# EAGLE design kicker (EAGLE 9.6.2)
AUTHOR: Elias Michalk, Mike Schmidt; GENERATION: Pasta; TITLE: Kicker; VERSION: 04

## Sheet 1 of 3
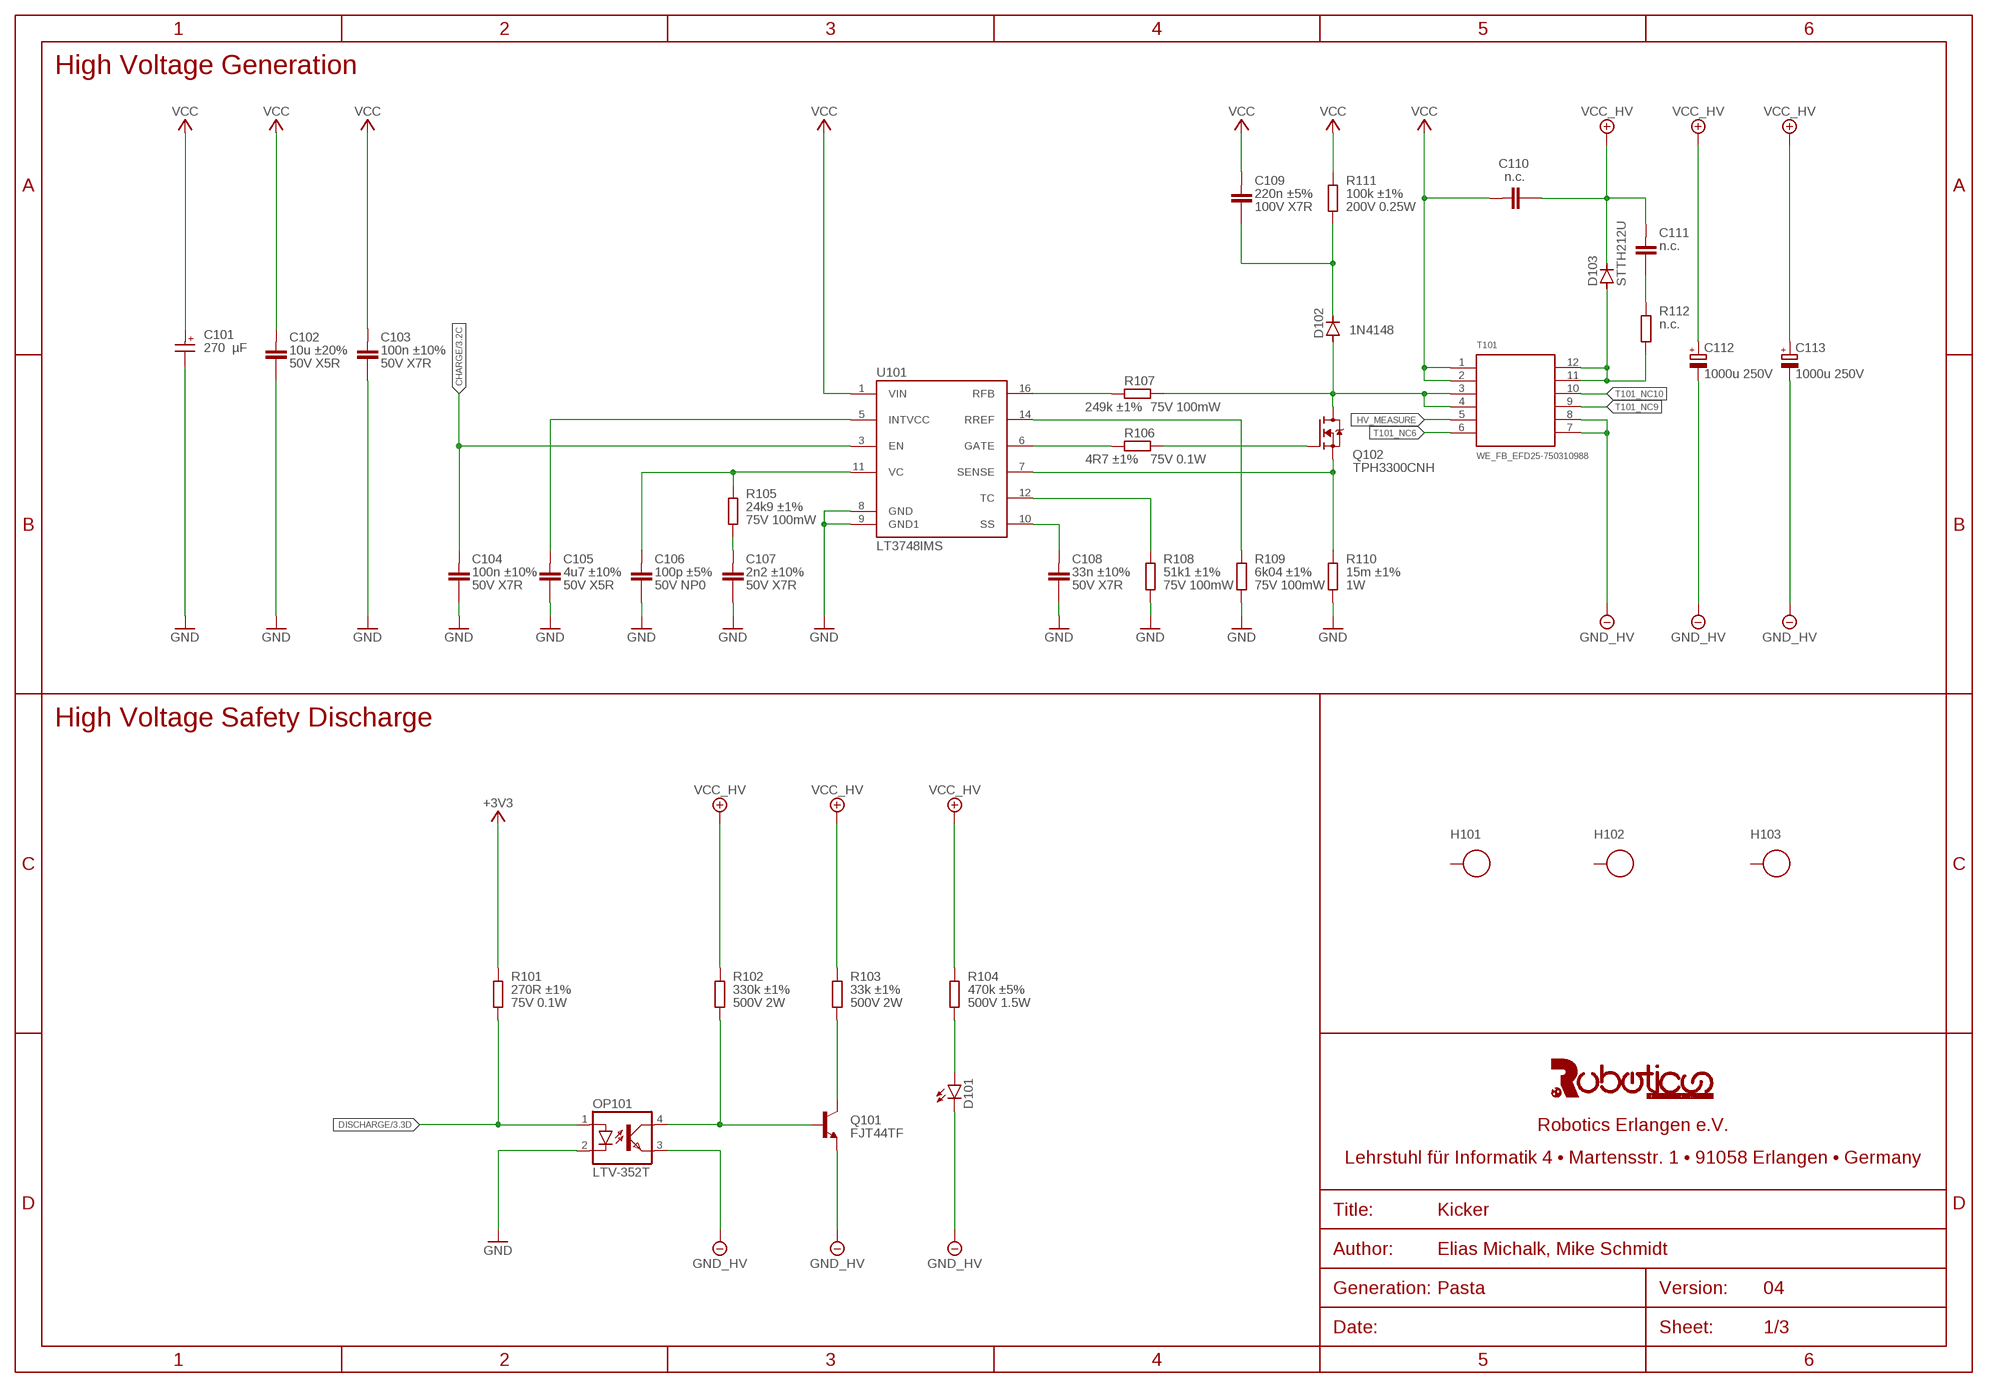
[diagram p0: schematic, sheet 1]

### Parts
C101  270 µF  WCAP-PSLC_10X12.4_875075661009  [WCAP-PSLC_10X12.4(DXL)]
C102  10u ±20% 50V X5R  C(10UF,50V,1206)  [C1206]
C103  100n ±10% 50V X7R  C(100NF,50V,0603)  [C0603]
C104  100n ±10% 50V X7R  C(100NF,50V,0603)  [C0603]
C105  4u7 ±10% 50V X5R  C(4.7UF,50V,0805)  [C0805]
C106  100p ±5% 50V NP0  C(100PF,50V,0603)  [C0603]
C107  2n2 ±10% 50V X7R  C(2.2NF,50V,0603)  [C0603]
C108  33n ±10% 50V X7R  C(33NF,50V,0603)  [C0603]
C109  C(1210)  [C1210]
C110  n.c.  C(N.C.,1206)  [C1206]
C111  n.c.  C(N.C.,1206)  [C1206]
C112  1000u 250V  ESMQ251VSN102MQ45S  [ESMQ251VSN102MQ45S]
C113  1000u 250V  ESMQ251VSN102MQ45S  [ESMQ251VSN102MQ45S]
D101  LED5MM  [LED5MM]
D102  1N4148  1N4148W  [SOD-123]
D103  STTH212U  [SMB]
H101  9774060360R  [9774***360]
H102  9774060360R  [9774***360]
H103  9774060360R  [9774***360]
OP101  LTV-352T  [DIL4-SMD]
Q101  FJT44TF  TRANSISTOR_NPN"  [SOT223]
Q102  TPH3300CNH  [SOP-8]
R101  270R ±1% 75V 0.1W  R(270R,75V,0.1W,0603)  [R0603]
R102  R(2512)  [R2512]
R103  R(2512)  [R2512]
R104  R(2512)  [R2512]
R105  R(0603)  [R0603]
R106  4R7 ±1% 75V 0.1W  R(4.7R,75V,0.1W,0603)  [R0603]
R107  R(0603)  [R0603]
R108  R(0603)  [R0603]
R109  R(0603)  [R0603]
R110  R(1206)  [R1206]
R111  100k ±1% 200V 0.25W  R(100K,200V,0.25W,1206)  [R1206]
R112  n.c.  R(N.C.,1206)  [R1206]
T101  WE_FB_EFD25-750310988  [WE_FB_EFD25]
U101  LT3748IMS  [MSOP16]

### Nets
+3V3: R101.2 ; also sheet 2,3
CHARGE: C104.1 U101.3(EN) ; also sheet 3
DISCHARGE: OP101.1(A) R101.1 ; also sheet 3
GND: C101.2(-) C102.2 C103.2 C104.2 C105.2 C106.2 C107.2 C108.2 OP101.2(C) R108.1 R109.1 R110.1 U101.8(GND) U101.9(GND1) ; also sheet 2,3
GND_HV [HV: 0V - 30V]: C112.N(-) C113.N(-) D101.K(C) OP101.3(EMIT) Q101.3(E) T101.7 T101.8 ; also sheet 2,3
HV_MEASURE [HV: 0V - 250V]: T101.5
N$1: R108.2 U101.12(TC)
N$3 [HV: 0V - 250V]: D103.A R112.1 T101.11 T101.12
N$4: R109.2 U101.14(RREF)
N$8: C108.1 U101.10(SS)
N$9 [HV: 0V - 30V]: D101.A R104.1
N$10 [LV: 0V - 100V]: C109.2 D102.C R111.1
N$13: Q102.1(S) Q102.2(S) Q102.3(S) R110.2 U101.7(SENSE)
N$14: C105.1 U101.5(INTVCC)
N$16: C106.1 R105.2 U101.11(VC)
N$17: C107.1 R105.1
N$18: Q102.4(G) R106.1
N$19: R106.2 U101.6(GATE)
N$21 [LV: 0V - 100V]: R107.2 U101.16(RFB)
N$26 [HV: 0V - 250V]: C111.2 R112.2
N$41 [HV: 0V - 30V]: OP101.4(COL) Q101.1(B) R102.1
N$43 [HV: 0V - 250V]: Q101.2(C) Q101.4(C) R103.1
T101_NC6 [NC]: T101.6
T101_NC9 [NC]: T101.9
T101_NC10 [NC]: T101.10
TRAFO [LV: 0V - 100V]: D102.A Q102.5(D) R107.1 T101.3 T101.4
VCC: C101.1(+) C102.1 C103.1 C109.1 C110.1 R111.2 T101.1 T101.2 U101.1(VIN) ; also sheet 2,3
VCC_HV [HV: 250V]: C110.2 C111.1 C112.P(+) C113.P(+) D103.C R102.2 R103.2 R104.2 ; also sheet 2,3
Unconnected: H101.1 H102.1 H103.1

### Notes on the sheet
- High Voltage Generation
- High Voltage Safety Discharge

## Sheet 2 of 3
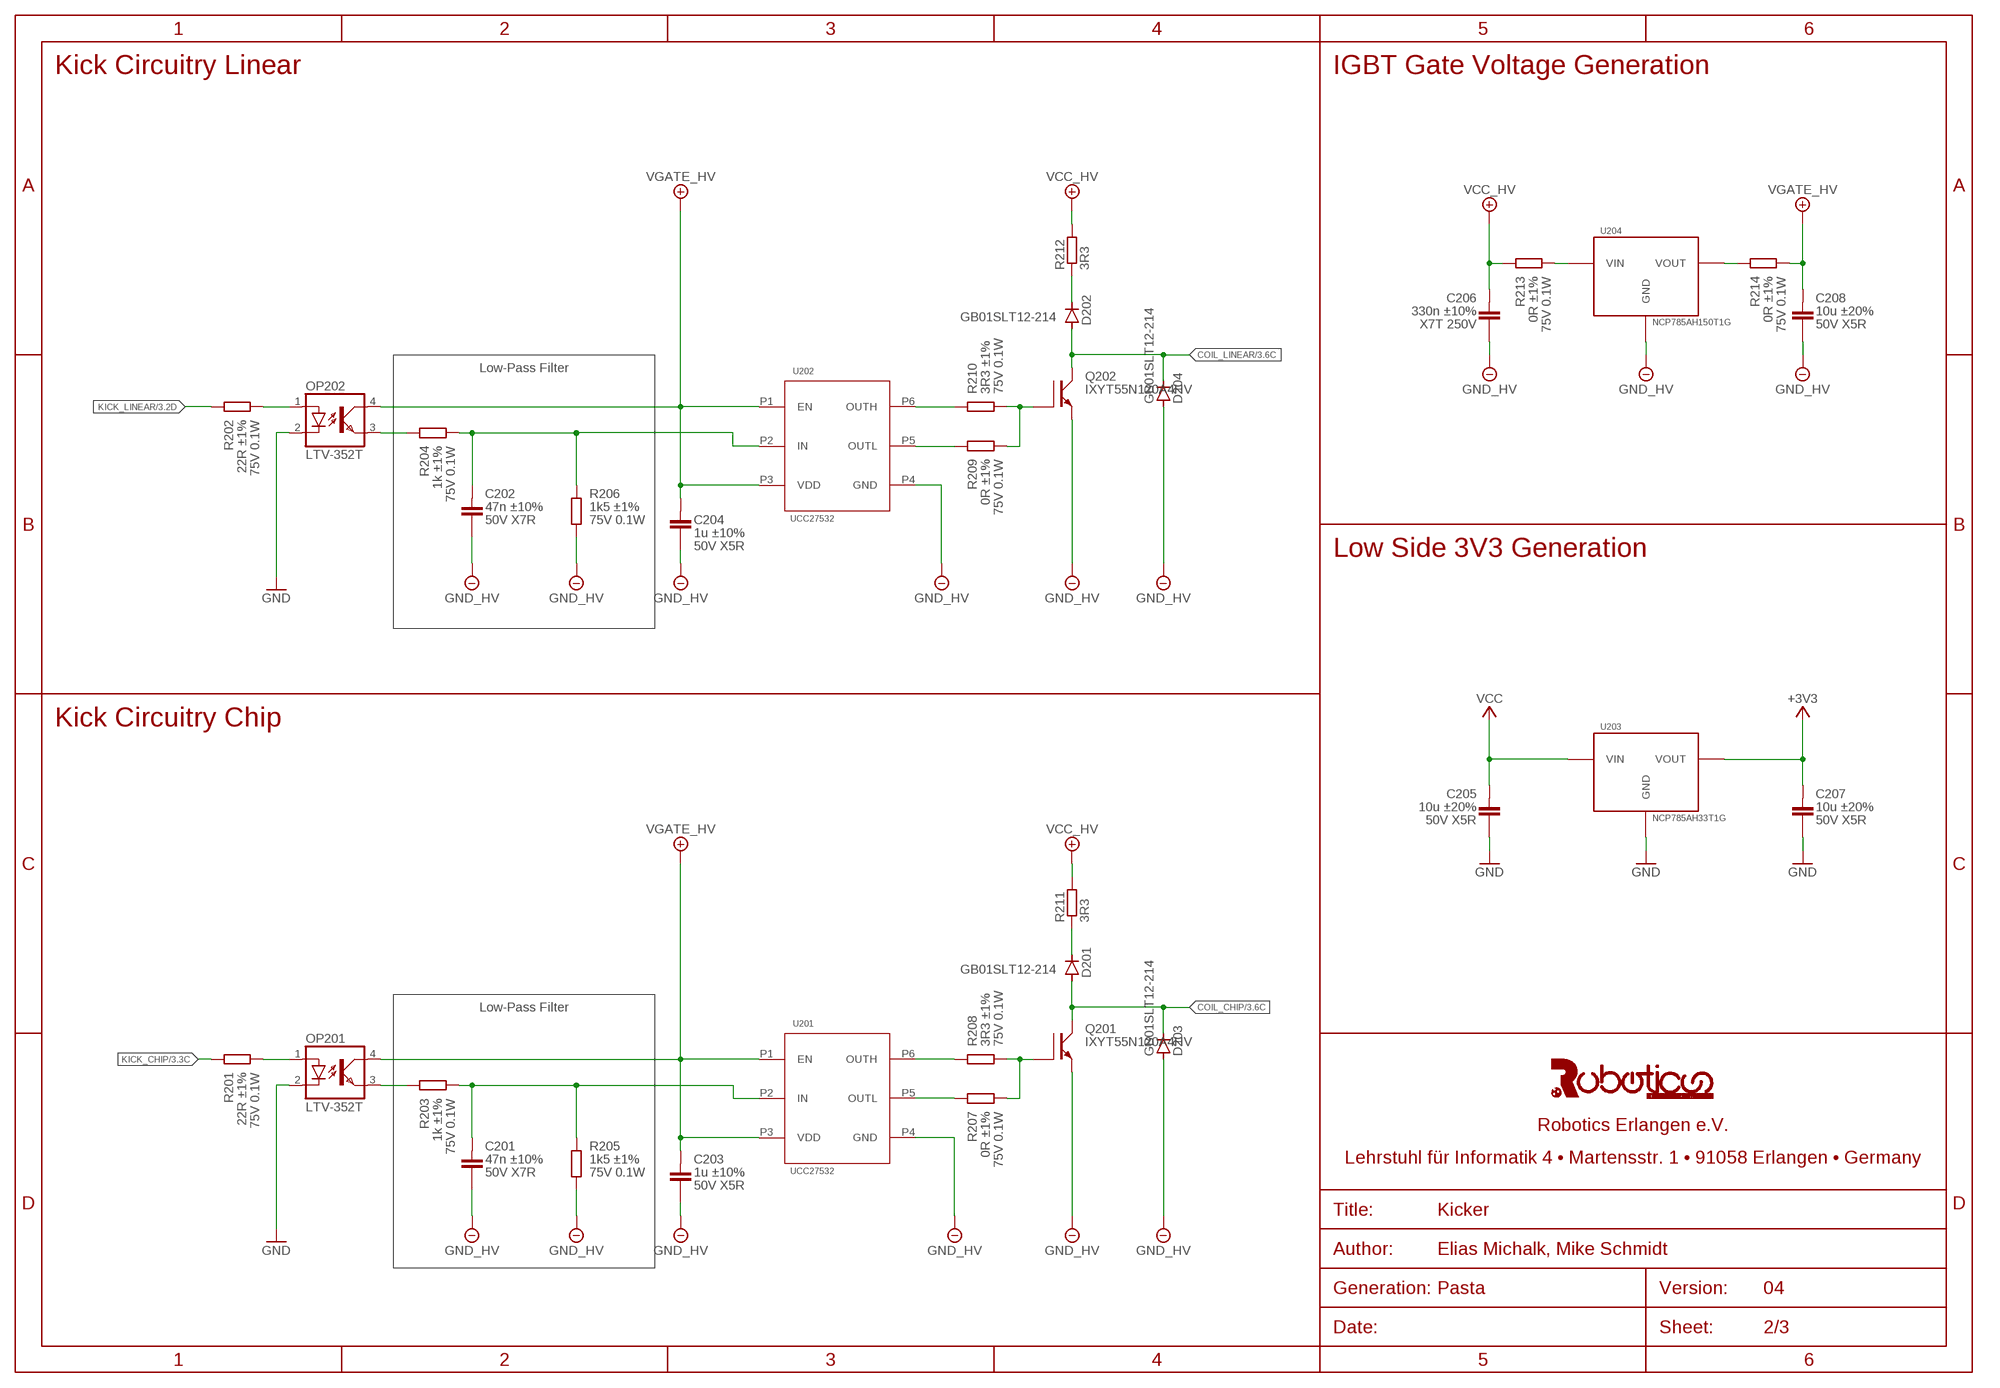
[diagram p1: schematic, sheet 2]

### Parts
C201  47n ±10% 50V X7R  C(47NF,50V,0603)  [C0603]
C202  47n ±10% 50V X7R  C(47NF,50V,0603)  [C0603]
C203  1u ±10% 50V X5R  C(1.0UF,50V,0603)  [C0603]
C204  1u ±10% 50V X5R  C(1.0UF,50V,0603)  [C0603]
C205  10u ±20% 50V X5R  C(10UF,50V,1206)  [C1206]
C206  C(1210)  [C1210]
C207  10u ±20% 50V X5R  C(10UF,50V,1206)  [C1206]
C208  10u ±20% 50V X5R  C(10UF,50V,1206)  [C1206]
D201  GB01SLT12-214  [DO-214]
D202  GB01SLT12-214  [DO-214]
D203  GB01SLT12-214  [DO-214]
D204  GB01SLT12-214  [DO-214]
OP201  LTV-352T  [DIL4-SMD]
OP202  LTV-352T  [DIL4-SMD]
Q201  IXYT55N120A4HV  [TO-268HV]
Q202  IXYT55N120A4HV  [TO-268HV]
R201  22R ±1% 75V 0.1W  R(22R,75V,0.1W,0603)  [R0603]
R202  22R ±1% 75V 0.1W  R(22R,75V,0.1W,0603)  [R0603]
R203  1k ±1% 75V 0.1W  R(1.0K,75V,0.1W,0603)  [R0603]
R204  1k ±1% 75V 0.1W  R(1.0K,75V,0.1W,0603)  [R0603]
R205  1k5 ±1% 75V 0.1W  R(1.5K,75V,0.1W,0603)  [R0603]
R206  1k5 ±1% 75V 0.1W  R(1.5K,75V,0.1W,0603)  [R0603]
R207  0R ±1% 75V 0.1W  R(0R,75V,0.1W,0603)  [R0603]
R208  3R3 ±1% 75V 0.1W  R(3.3R,75V,0.1W,0603)  [R0603]
R209  0R ±1% 75V 0.1W  R(0R,75V,0.1W,0603)  [R0603]
R210  3R3 ±1% 75V 0.1W  R(3.3R,75V,0.1W,0603)  [R0603]
R211  3R3  R-EU_3R3-R4527  [R4527]
R212  3R3  R-EU_3R3-R4527  [R4527]
R213  0R ±1% 75V 0.1W  R(0R,75V,0.1W,0603)  [R0603]
R214  0R ±1% 75V 0.1W  R(0R,75V,0.1W,0603)  [R0603]
U201  UCC27532  [SOT23-6]
U202  UCC27532  [SOT23-6]
U203  NCP785AH33T1G  [NCP785AH*T1G]
U204  NCP785AH150T1G  [NCP785AH*T1G]

### Nets
+3V3: C207.1 U203.3(VOUT) ; also sheet 1,3
COIL_CHIP [HV: 0V - 250V]: D201.A D203.C Q201.3(C) ; also sheet 3
COIL_LINEAR [HV: 0V - 250V]: D202.A D204.C Q202.3(C) ; also sheet 3
GND: C205.2 C207.2 OP201.2(C) OP202.2(C) U203.2(GND) ; also sheet 1,3
GND_HV [HV: 0V - 30V]: C201.2 C202.2 C203.2 C204.2 C206.2 C208.2 D203.A D204.A Q201.1(E) Q202.1(E) R205.1 R206.1 U201.P4(GND) U202.P4(GND) U204.2(GND) ; also sheet 1,3
KICK_CHIP: R201.1 ; also sheet 3
KICK_LINEAR: R202.1 ; also sheet 3
N$2 [HV: 0V - 30V]: OP202.3(EMIT) R204.1
N$5 [HV: 0V - 30V]: OP201.3(EMIT) R203.1
N$7 [HV: 250V]: R213.2 U204.1(VIN)
N$15 [HV: 0V - 30V]: R214.1 U204.3(VOUT)
N$22 [HV: 0V - 30V]: R208.1 U201.P6(OUTH)
N$23 [HV: 0V - 30V]: R210.1 U202.P6(OUTH)
N$24 [HV: 0V - 30V]: R209.1 U202.P5(OUTL)
N$25 [HV: 0V - 30V]: Q202.2(G) R209.2 R210.2
N$27 [HV: 0V - 30V]: C202.1 R204.2 R206.2 U202.P2(IN)
N$28 [HV: 0V - 30V]: R207.1 U201.P5(OUTL)
N$29 [HV: 0V - 30V]: Q201.2(G) R207.2 R208.2
N$30: D202.C R212.1
N$31: OP201.1(A) R201.2
N$33: D201.C R211.1
N$34 [HV: 0V - 30V]: C201.1 R203.2 R205.2 U201.P2(IN)
N$48: OP202.1(A) R202.2
VCC: C205.1 U203.1(VIN) ; also sheet 1,3
VCC_HV [HV: 250V]: C206.1 R211.2 R212.2 R213.1 ; also sheet 1,3
VGATE_HV [HV: 0V - 30V]: C203.1 C204.1 C208.1 OP201.4(COL) OP202.4(COL) R214.2 U201.P1(EN) U201.P3(VDD) U202.P1(EN) U202.P3(VDD) ; also sheet 3

### Notes on the sheet
- Kick Circuitry Linear | IGBT Gate Voltage Generation
- Low-Pass Filter
- Low Side 3V3 Generation
- Kick Circuitry Chip
- Low-Pass Filter

## Sheet 3 of 3
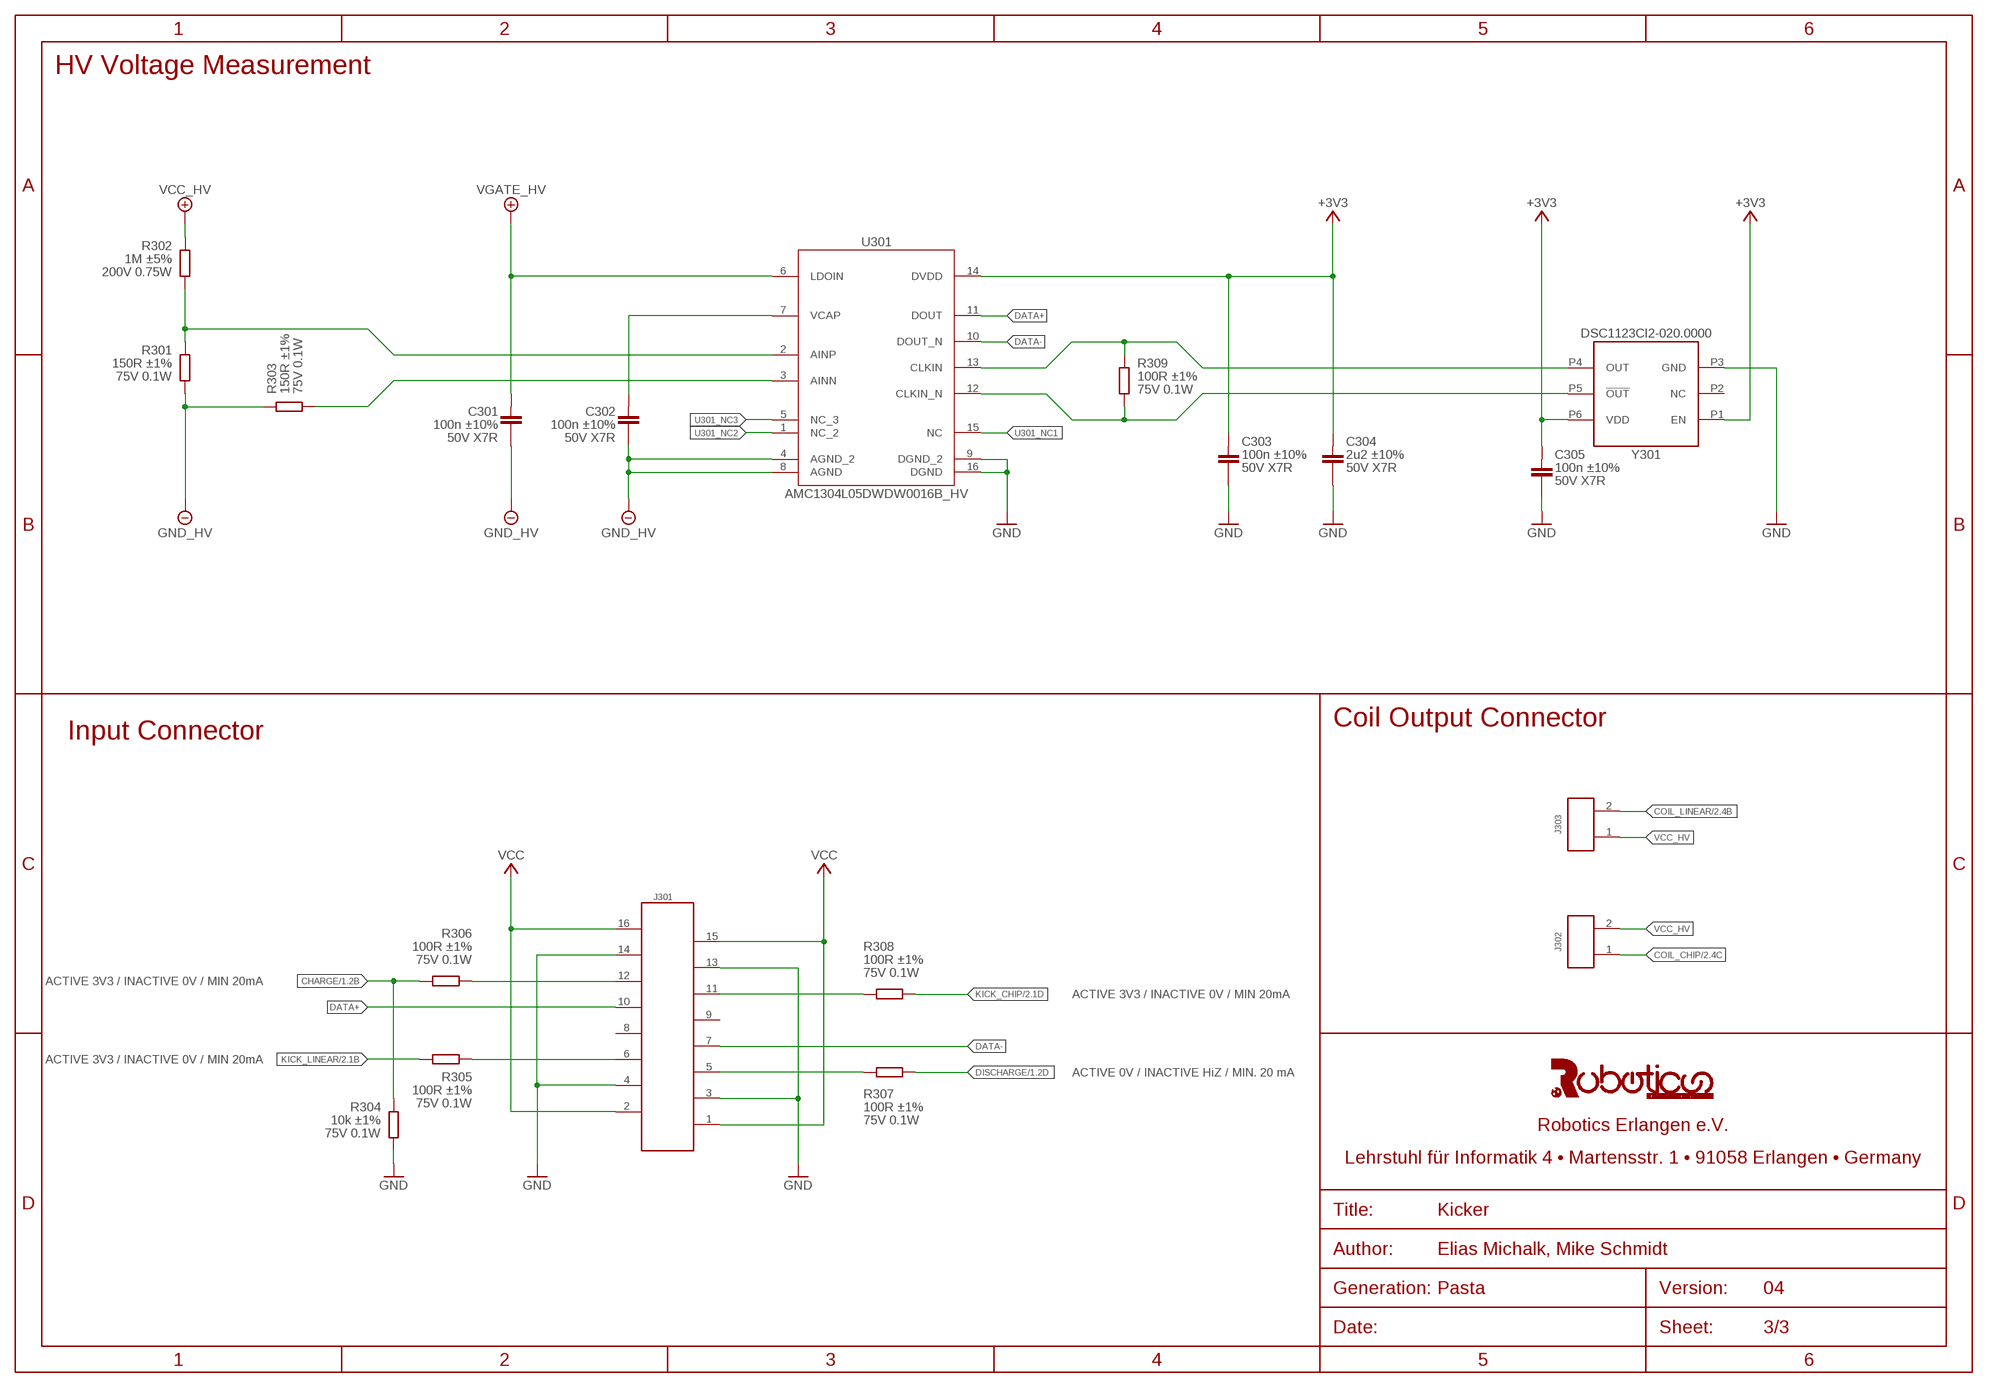
[diagram p2: schematic, sheet 3]

### Parts
C301  100n ±10% 50V X7R  C(100NF,50V,0603)  [C0603]
C302  100n ±10% 50V X7R  C(100NF,50V,0603)  [C0603]
C303  100n ±10% 50V X7R  C(100NF,50V,0603)  [C0603]
C304  2u2 ±10% 50V X7R  C(2.2UF,50V,0805)  [C0805]
C305  100n ±10% 50V X7R  C(100NF,50V,0603)  [C0603]
J301  690367181672  [690367181672]
J302  66100311622  [66100311622*]
J303  66100311622  [66100311622*]
R301  150R ±1% 75V 0.1W  R(150R,75V,0.1W,0603)  [R0603]
R302  R(2010)  [R2010]
R303  150R ±1% 75V 0.1W  R(150R,75V,0.1W,0603)  [R0603]
R304  10k ±1% 75V 0.1W  R(10K,75V,0.1W,0603)  [R0603]
R305  100R ±1% 75V 0.1W  R(100R,75V,0.1W,0603)  [R0603]
R306  100R ±1% 75V 0.1W  R(100R,75V,0.1W,0603)  [R0603]
R307  100R ±1% 75V 0.1W  R(100R,75V,0.1W,0603)  [R0603]
R308  100R ±1% 75V 0.1W  R(100R,75V,0.1W,0603)  [R0603]
R309  100R ±1% 75V 0.1W  R(100R,75V,0.1W,0603)  [R0603]
U301  AMC1304L05DWDW0016B_HV  [DW0016B_HV]
Y301  DSC1123CI2-020.0000  [DSC11X3]

### Nets
+3V3: C303.1 C304.1 C305.1 U301.14(DVDD) Y301.P1(EN) Y301.P6(VDD) ; also sheet 1,2
CHARGE: R304.2 R306.2 ; also sheet 1
CLK-: R309.1 U301.12(CLKIN_N) Y301.P5(!OUT)
COIL_CHIP [HV: 0V - 250V]: J302.1 ; also sheet 2
COIL_LINEAR [HV: 0V - 250V]: J303.2 ; also sheet 2
DATA+: J301.10 U301.11(DOUT)
DATA-: J301.7 U301.10(DOUT_N)
DISCHARGE: R307.2 ; also sheet 1
GND: C303.2 C304.2 C305.2 J301.3 J301.4 J301.13 J301.14 R304.1 U301.9(DGND_2) U301.16(DGND) Y301.P3(GND) ; also sheet 1,2
GND_HV [HV: 0V - 30V]: C301.2 C302.2 R301.1 R303.2 U301.4(AGND_2) U301.8(AGND) ; also sheet 1,2
KICK_CHIP: R308.1 ; also sheet 2
KICK_LINEAR: R305.2 ; also sheet 2
N$6: R309.2 U301.13(CLKIN) Y301.P4(OUT)
N$12 [HV: 0V - 30V]: R301.2 R302.1 U301.2(AINP)
N$20 [HV: 0V - 30V]: R303.1 U301.3(AINN)
N$32: J301.12 R306.1
N$37: J301.6 R305.1
N$38: J301.5 R307.1
N$39 [HV: 0V - 30V]: C302.1 U301.7(VCAP)
N$42: J301.11 R308.2
U301_NC1 [NC]: U301.15(NC)
U301_NC2 [NC]: U301.1(NC_2)
U301_NC3 [NC]: U301.5(NC_3)
VCC: J301.1 J301.2 J301.15 J301.16 ; also sheet 1,2
VCC_HV [HV: 250V]: J302.2 J303.1 R302.2 ; also sheet 1,2
VGATE_HV [HV: 0V - 30V]: C301.1 U301.6(LDOIN) ; also sheet 2
Unconnected: J301.8 J301.9 Y301.P2(NC)

### Notes on the sheet
- HV Voltage Measurement
- Coil Output Connector
- Input Connector
- ACTIVE 3V3 / INACTIVE 0V / MIN 20mA
- ACTIVE 3V3 / INACTIVE 0V / MIN 20mA
- ACTIVE 3V3 / INACTIVE 0V / MIN 20mA
- ACTIVE 0V / INACTIVE HiZ / MIN. 20 mA

## Library data of the parts
C101 = kicker:WCAP-PSLC_10X12.4: WCAP-PSLC Aluminum Polymer Capacitors Large Capacitance Characteristics Large capacitance product series Low ESR over high frequency range High permissible ripple current Mounting style: V-Chip SMT Capacitance range: 10 µF ‒ 2000 µF Capacitance tolerance: ±20 % Voltage range (UR): 6.3 ‒ 100 V(DC) Operating temperature: -55 °C up to +105 °C Endurance: 2000h @ +105 °C Dimensions (DxL) in mm: 8.0 x 11.7 up to 10.0 x 12.4 Recommended soldering: Reflow soldering Applications Low ripple voltage at the switching converter Filtering Smoothing Coupling e.g. High-end power supply, industrial computer, VGA card, charger, digital set-top box <https://www.we-online.com/catalog/media/o14736v209%20Family_WCAP-PSLC.jpg> Details see: https://www.we-online.com/catalog/en/WCAP-PSLC/ Updated by Ella Wu;2020-08-14 2020(C) Würth Elektronik; MF: Würth Elektronik; MPN: 875075661009; TOLERANCE: ±10%; VOLTAGE: 35V(DC)
C102 C205 C207 C208 = capacitors:C(*?): Robotics Erlangen Capacitor Library This library provides a list of predefined capacitors with the following features: It is guaranteed that the capacitor exists with the given value, voltage rating and package size If you choose the capacitor you need (e.g. 2u2 with at least 50V) the package will be automatically choosen The manufacturer's data is automatically added so that exactly that capacitor will be ordered The value of the capacitor will be automatically filled with the most relevant data To choose a capacitor, you need to think about the voltage it must be rated for acc. to your application. Use below table to get a minimum voltage rating for the capacitor, depending on the maximum voltage that will be applied to it in your application. Maximum Voltage Applied Notes Minimum Voltage Rating ≤ 3.3V ≥ 6V3 ≤ 5.0V ≥ 10V ≤ 16.8V ≥ 25V ≤ 33.6V Includes all signals that are at max. VCC ≥ 50V After you determined the minimum voltage rating of the capacitor, search for it in the database of this library and choose the first one, that has at least that rating. The library is primarily sorted by capacitance values. Never change the value of predefined capacitors! Note: If your project requires a very specific capacitor (e.g. low tolerance, high voltage or E-24 upwards), then choose any of the predefined empty devices C(0402), C(0603), C(0805), C(1206), C(1210), or C(1812). Always set the attributes MF, MPN and VALUE for custom capacitors!; CAPACITANCE: 10u; DIELECTRIC: X5R; LINE1: 10u ±20%; LINE2: 50V X5R; MF: Samsung; MPN: CL31A106MBHNNNE; TOLERANCE: ±20%; VOLTAGE: 50V
C103 C104 C301-C303 C305 = capacitors:C(*?): Robotics Erlangen Capacitor Library This library provides a list of predefined capacitors with the following features: It is guaranteed that the capacitor exists with the given value, voltage rating and package size If you choose the capacitor you need (e.g. 2u2 with at least 50V) the package will be automatically choosen The manufacturer's data is automatically added so that exactly that capacitor will be ordered The value of the capacitor will be automatically filled with the most relevant data To choose a capacitor, you need to think about the voltage it must be rated for acc. to your application. Use below table to get a minimum voltage rating for the capacitor, depending on the maximum voltage that will be applied to it in your application. Maximum Voltage Applied Notes Minimum Voltage Rating ≤ 3.3V ≥ 6V3 ≤ 5.0V ≥ 10V ≤ 16.8V ≥ 25V ≤ 33.6V Includes all signals that are at max. VCC ≥ 50V After you determined the minimum voltage rating of the capacitor, search for it in the database of this library and choose the first one, that has at least that rating. The library is primarily sorted by capacitance values. Never change the value of predefined capacitors! Note: If your project requires a very specific capacitor (e.g. low tolerance, high voltage or E-24 upwards), then choose any of the predefined empty devices C(0402), C(0603), C(0805), C(1206), C(1210), or C(1812). Always set the attributes MF, MPN and VALUE for custom capacitors!; CAPACITANCE: 100n; DIELECTRIC: X7R; LINE1: 100n ±10%; LINE2: 50V X7R; MF: Würth Elektronik; MPN: 885012206095; TOLERANCE: ±10%; VOLTAGE: 50V
C105 = capacitors:C(*?): Robotics Erlangen Capacitor Library This library provides a list of predefined capacitors with the following features: It is guaranteed that the capacitor exists with the given value, voltage rating and package size If you choose the capacitor you need (e.g. 2u2 with at least 50V) the package will be automatically choosen The manufacturer's data is automatically added so that exactly that capacitor will be ordered The value of the capacitor will be automatically filled with the most relevant data To choose a capacitor, you need to think about the voltage it must be rated for acc. to your application. Use below table to get a minimum voltage rating for the capacitor, depending on the maximum voltage that will be applied to it in your application. Maximum Voltage Applied Notes Minimum Voltage Rating ≤ 3.3V ≥ 6V3 ≤ 5.0V ≥ 10V ≤ 16.8V ≥ 25V ≤ 33.6V Includes all signals that are at max. VCC ≥ 50V After you determined the minimum voltage rating of the capacitor, search for it in the database of this library and choose the first one, that has at least that rating. The library is primarily sorted by capacitance values. Never change the value of predefined capacitors! Note: If your project requires a very specific capacitor (e.g. low tolerance, high voltage or E-24 upwards), then choose any of the predefined empty devices C(0402), C(0603), C(0805), C(1206), C(1210), or C(1812). Always set the attributes MF, MPN and VALUE for custom capacitors!; CAPACITANCE: 4u7; DIELECTRIC: X5R; LINE1: 4u7 ±10%; LINE2: 50V X5R; MF: Samsung; MPN: CL21A475KBQNNNE; TOLERANCE: ±10%; VOLTAGE: 50V
C106 = capacitors:C(*?): Robotics Erlangen Capacitor Library This library provides a list of predefined capacitors with the following features: It is guaranteed that the capacitor exists with the given value, voltage rating and package size If you choose the capacitor you need (e.g. 2u2 with at least 50V) the package will be automatically choosen The manufacturer's data is automatically added so that exactly that capacitor will be ordered The value of the capacitor will be automatically filled with the most relevant data To choose a capacitor, you need to think about the voltage it must be rated for acc. to your application. Use below table to get a minimum voltage rating for the capacitor, depending on the maximum voltage that will be applied to it in your application. Maximum Voltage Applied Notes Minimum Voltage Rating ≤ 3.3V ≥ 6V3 ≤ 5.0V ≥ 10V ≤ 16.8V ≥ 25V ≤ 33.6V Includes all signals that are at max. VCC ≥ 50V After you determined the minimum voltage rating of the capacitor, search for it in the database of this library and choose the first one, that has at least that rating. The library is primarily sorted by capacitance values. Never change the value of predefined capacitors! Note: If your project requires a very specific capacitor (e.g. low tolerance, high voltage or E-24 upwards), then choose any of the predefined empty devices C(0402), C(0603), C(0805), C(1206), C(1210), or C(1812). Always set the attributes MF, MPN and VALUE for custom capacitors!; CAPACITANCE: 100p; DIELECTRIC: NP0; LINE1: 100p ±5%; LINE2: 50V NP0; MF: Würth Elektronik; MPN: 885012006057; TOLERANCE: ±5%; VOLTAGE: 50V
C107 = capacitors:C(*?): Robotics Erlangen Capacitor Library This library provides a list of predefined capacitors with the following features: It is guaranteed that the capacitor exists with the given value, voltage rating and package size If you choose the capacitor you need (e.g. 2u2 with at least 50V) the package will be automatically choosen The manufacturer's data is automatically added so that exactly that capacitor will be ordered The value of the capacitor will be automatically filled with the most relevant data To choose a capacitor, you need to think about the voltage it must be rated for acc. to your application. Use below table to get a minimum voltage rating for the capacitor, depending on the maximum voltage that will be applied to it in your application. Maximum Voltage Applied Notes Minimum Voltage Rating ≤ 3.3V ≥ 6V3 ≤ 5.0V ≥ 10V ≤ 16.8V ≥ 25V ≤ 33.6V Includes all signals that are at max. VCC ≥ 50V After you determined the minimum voltage rating of the capacitor, search for it in the database of this library and choose the first one, that has at least that rating. The library is primarily sorted by capacitance values. Never change the value of predefined capacitors! Note: If your project requires a very specific capacitor (e.g. low tolerance, high voltage or E-24 upwards), then choose any of the predefined empty devices C(0402), C(0603), C(0805), C(1206), C(1210), or C(1812). Always set the attributes MF, MPN and VALUE for custom capacitors!; CAPACITANCE: 2n2; DIELECTRIC: X7R; LINE1: 2n2 ±10%; LINE2: 50V X7R; MF: Würth Elektronik; MPN: 885012206085; TOLERANCE: ±10%; VOLTAGE: 50V
C108 = capacitors:C(*?): Robotics Erlangen Capacitor Library This library provides a list of predefined capacitors with the following features: It is guaranteed that the capacitor exists with the given value, voltage rating and package size If you choose the capacitor you need (e.g. 2u2 with at least 50V) the package will be automatically choosen The manufacturer's data is automatically added so that exactly that capacitor will be ordered The value of the capacitor will be automatically filled with the most relevant data To choose a capacitor, you need to think about the voltage it must be rated for acc. to your application. Use below table to get a minimum voltage rating for the capacitor, depending on the maximum voltage that will be applied to it in your application. Maximum Voltage Applied Notes Minimum Voltage Rating ≤ 3.3V ≥ 6V3 ≤ 5.0V ≥ 10V ≤ 16.8V ≥ 25V ≤ 33.6V Includes all signals that are at max. VCC ≥ 50V After you determined the minimum voltage rating of the capacitor, search for it in the database of this library and choose the first one, that has at least that rating. The library is primarily sorted by capacitance values. Never change the value of predefined capacitors! Note: If your project requires a very specific capacitor (e.g. low tolerance, high voltage or E-24 upwards), then choose any of the predefined empty devices C(0402), C(0603), C(0805), C(1206), C(1210), or C(1812). Always set the attributes MF, MPN and VALUE for custom capacitors!; CAPACITANCE: 33n; DIELECTRIC: X7R; LINE1: 33n ±10%; LINE2: 50V X7R; MF: Würth Elektronik; MPN: 885012206092; TOLERANCE: ±10%; VOLTAGE: 50V
C109 = capacitors:C(*?): Robotics Erlangen Capacitor Library This library provides a list of predefined capacitors with the following features: It is guaranteed that the capacitor exists with the given value, voltage rating and package size If you choose the capacitor you need (e.g. 2u2 with at least 50V) the package will be automatically choosen The manufacturer's data is automatically added so that exactly that capacitor will be ordered The value of the capacitor will be automatically filled with the most relevant data To choose a capacitor, you need to think about the voltage it must be rated for acc. to your application. Use below table to get a minimum voltage rating for the capacitor, depending on the maximum voltage that will be applied to it in your application. Maximum Voltage Applied Notes Minimum Voltage Rating ≤ 3.3V ≥ 6V3 ≤ 5.0V ≥ 10V ≤ 16.8V ≥ 25V ≤ 33.6V Includes all signals that are at max. VCC ≥ 50V After you determined the minimum voltage rating of the capacitor, search for it in the database of this library and choose the first one, that has at least that rating. The library is primarily sorted by capacitance values. Never change the value of predefined capacitors! Note: If your project requires a very specific capacitor (e.g. low tolerance, high voltage or E-24 upwards), then choose any of the predefined empty devices C(0402), C(0603), C(0805), C(1206), C(1210), or C(1812). Always set the attributes MF, MPN and VALUE for custom capacitors!; CAPACITANCE: 220nF; DIELECTRIC: X7R; LINE1: 220n ±5%; LINE2: 100V X7R; MF: KEMET; MPN: C0805C224J1RECTU; TOLERANCE: ±5%; VOLTAGE: 100V
C110 C111 = capacitors:C(*?): Robotics Erlangen Capacitor Library This library provides a list of predefined capacitors with the following features: It is guaranteed that the capacitor exists with the given value, voltage rating and package size If you choose the capacitor you need (e.g. 2u2 with at least 50V) the package will be automatically choosen The manufacturer's data is automatically added so that exactly that capacitor will be ordered The value of the capacitor will be automatically filled with the most relevant data To choose a capacitor, you need to think about the voltage it must be rated for acc. to your application. Use below table to get a minimum voltage rating for the capacitor, depending on the maximum voltage that will be applied to it in your application. Maximum Voltage Applied Notes Minimum Voltage Rating ≤ 3.3V ≥ 6V3 ≤ 5.0V ≥ 10V ≤ 16.8V ≥ 25V ≤ 33.6V Includes all signals that are at max. VCC ≥ 50V After you determined the minimum voltage rating of the capacitor, search for it in the database of this library and choose the first one, that has at least that rating. The library is primarily sorted by capacitance values. Never change the value of predefined capacitors! Note: If your project requires a very specific capacitor (e.g. low tolerance, high voltage or E-24 upwards), then choose any of the predefined empty devices C(0402), C(0603), C(0805), C(1206), C(1210), or C(1812). Always set the attributes MF, MPN and VALUE for custom capacitors!; CAPACITANCE: n.c.; LINE1: n.c.
C112 C113 = kicker:ESMQ251VSN102MQ45S; MF: United Chemi-Con; MOUSER: 661-ESMQ251VSN102MQ4; MPN: ESMQ251VSN102MQ45S
C201 C202 = capacitors:C(*?): Robotics Erlangen Capacitor Library This library provides a list of predefined capacitors with the following features: It is guaranteed that the capacitor exists with the given value, voltage rating and package size If you choose the capacitor you need (e.g. 2u2 with at least 50V) the package will be automatically choosen The manufacturer's data is automatically added so that exactly that capacitor will be ordered The value of the capacitor will be automatically filled with the most relevant data To choose a capacitor, you need to think about the voltage it must be rated for acc. to your application. Use below table to get a minimum voltage rating for the capacitor, depending on the maximum voltage that will be applied to it in your application. Maximum Voltage Applied Notes Minimum Voltage Rating ≤ 3.3V ≥ 6V3 ≤ 5.0V ≥ 10V ≤ 16.8V ≥ 25V ≤ 33.6V Includes all signals that are at max. VCC ≥ 50V After you determined the minimum voltage rating of the capacitor, search for it in the database of this library and choose the first one, that has at least that rating. The library is primarily sorted by capacitance values. Never change the value of predefined capacitors! Note: If your project requires a very specific capacitor (e.g. low tolerance, high voltage or E-24 upwards), then choose any of the predefined empty devices C(0402), C(0603), C(0805), C(1206), C(1210), or C(1812). Always set the attributes MF, MPN and VALUE for custom capacitors!; CAPACITANCE: 47n; DIELECTRIC: X7R; LINE1: 47n ±10%; LINE2: 50V X7R; MF: Würth Elektronik; MPN: 885012206093; TOLERANCE: ±10%; VOLTAGE: 50V
C203 C204 = capacitors:C(*?): Robotics Erlangen Capacitor Library This library provides a list of predefined capacitors with the following features: It is guaranteed that the capacitor exists with the given value, voltage rating and package size If you choose the capacitor you need (e.g. 2u2 with at least 50V) the package will be automatically choosen The manufacturer's data is automatically added so that exactly that capacitor will be ordered The value of the capacitor will be automatically filled with the most relevant data To choose a capacitor, you need to think about the voltage it must be rated for acc. to your application. Use below table to get a minimum voltage rating for the capacitor, depending on the maximum voltage that will be applied to it in your application. Maximum Voltage Applied Notes Minimum Voltage Rating ≤ 3.3V ≥ 6V3 ≤ 5.0V ≥ 10V ≤ 16.8V ≥ 25V ≤ 33.6V Includes all signals that are at max. VCC ≥ 50V After you determined the minimum voltage rating of the capacitor, search for it in the database of this library and choose the first one, that has at least that rating. The library is primarily sorted by capacitance values. Never change the value of predefined capacitors! Note: If your project requires a very specific capacitor (e.g. low tolerance, high voltage or E-24 upwards), then choose any of the predefined empty devices C(0402), C(0603), C(0805), C(1206), C(1210), or C(1812). Always set the attributes MF, MPN and VALUE for custom capacitors!; CAPACITANCE: 1u; DIELECTRIC: X5R; LINE1: 1u ±10%; LINE2: 50V X5R; MF: Samsung; MPN: CL10A105KB8NNNC; TOLERANCE: ±10%; VOLTAGE: 50V
C206 = capacitors:C(*?): Robotics Erlangen Capacitor Library This library provides a list of predefined capacitors with the following features: It is guaranteed that the capacitor exists with the given value, voltage rating and package size If you choose the capacitor you need (e.g. 2u2 with at least 50V) the package will be automatically choosen The manufacturer's data is automatically added so that exactly that capacitor will be ordered The value of the capacitor will be automatically filled with the most relevant data To choose a capacitor, you need to think about the voltage it must be rated for acc. to your application. Use below table to get a minimum voltage rating for the capacitor, depending on the maximum voltage that will be applied to it in your application. Maximum Voltage Applied Notes Minimum Voltage Rating ≤ 3.3V ≥ 6V3 ≤ 5.0V ≥ 10V ≤ 16.8V ≥ 25V ≤ 33.6V Includes all signals that are at max. VCC ≥ 50V After you determined the minimum voltage rating of the capacitor, search for it in the database of this library and choose the first one, that has at least that rating. The library is primarily sorted by capacitance values. Never change the value of predefined capacitors! Note: If your project requires a very specific capacitor (e.g. low tolerance, high voltage or E-24 upwards), then choose any of the predefined empty devices C(0402), C(0603), C(0805), C(1206), C(1210), or C(1812). Always set the attributes MF, MPN and VALUE for custom capacitors!; CAPACITANCE: 330n; DIELECTRIC: X7T; LINE1: 330n ±10%; LINE2: X7T 250V; MF: TDK; MPN: C3225X7T2E334K200AA; TOLERANCE: ±10%; VOLTAGE: 250V
C304 = capacitors:C(*?): Robotics Erlangen Capacitor Library This library provides a list of predefined capacitors with the following features: It is guaranteed that the capacitor exists with the given value, voltage rating and package size If you choose the capacitor you need (e.g. 2u2 with at least 50V) the package will be automatically choosen The manufacturer's data is automatically added so that exactly that capacitor will be ordered The value of the capacitor will be automatically filled with the most relevant data To choose a capacitor, you need to think about the voltage it must be rated for acc. to your application. Use below table to get a minimum voltage rating for the capacitor, depending on the maximum voltage that will be applied to it in your application. Maximum Voltage Applied Notes Minimum Voltage Rating ≤ 3.3V ≥ 6V3 ≤ 5.0V ≥ 10V ≤ 16.8V ≥ 25V ≤ 33.6V Includes all signals that are at max. VCC ≥ 50V After you determined the minimum voltage rating of the capacitor, search for it in the database of this library and choose the first one, that has at least that rating. The library is primarily sorted by capacitance values. Never change the value of predefined capacitors! Note: If your project requires a very specific capacitor (e.g. low tolerance, high voltage or E-24 upwards), then choose any of the predefined empty devices C(0402), C(0603), C(0805), C(1206), C(1210), or C(1812). Always set the attributes MF, MPN and VALUE for custom capacitors!; CAPACITANCE: 2u2; DIELECTRIC: X7R; LINE1: 2u2 ±10%; LINE2: 50V X7R; MF: Samsung; MPN: CL21B225KBYNNWE; TOLERANCE: ±10%; VOLTAGE: 50V
D101 = kicker:LED; MF: Würth Elektronik; MPN: 151054RS03000
D102 = kicker:1N4148W: DIODE; MF: Micro Commercial Components; MPN: 1N4148W
D103 = kicker:STTH212U: DIODE; MF: STMicroelectronics; MPN: STTH212U
D201-D204 = kicker:GB01SLT12-214; MF: GeneSiC; MOUSER: 905-GB01SLT06-214; MPN: GB01SLT06-214
H101-H103 = kicker:9774*360R; MF: Würth Elektronik; MPN: 9774060360R
J301 = kicker:690367181672: WR-MM Female Connector without Latch and without Polarization, 16 Pins=>Code : Con_BTB_MM_Female_THT_St_690367181672 <http://katalog.we-online.de/media/thumbs2/eican/thb_Con_BTB_MM_Female_THT_St_69036718xx72_pf2.jpg> Details see: http://katalog.we-online.de/en/em/6903_6718_xx_72 Created 2014-06-04, Karrer Zheng 2014 (C) Würth Elektronik; MF: Würth Elektronik; MPN: 690367181672
J302 J303 = kicker:66100311622: Male Vertical Shrouded Header; MF: Würth Elektronik; MPN: 66100311622
OP101 OP201 OP202 = kicker:LTV-352T: OPTO COUPLER Source: LITEON, LTV816.pdf; MF: Lite-On; MOUSER: 859-LTV-352T; MPN: LTV-352T
Q101 = kicker:TRANSISTOR_NPN: Transistor NPN BJT configuration in SOT23 package. MMBT2222 is the common NPN we use. Double check BCE configuration again layout.; MF: onsemi / Fairchild; MPN: FJT44TF
Q102 = kicker:TPH3300CNH; MF: Toshiba; MOUSER: 757-TPH3300CNHL1Q; MPN: TPH3300CNH
Q201 Q202 = kicker:IXYT55N120A4HV; MF: IXYS; MOUSER: 747-IXYT55N120A4HV; MPN: IXYT55N120A4HV
R101 = resistors:R(*?): Robotics Erlangen Resistor Library This library provides a list of predefined resistors with the following features: It is guaranteed that the resistor exists with the given value, voltage rating and package size If you choose the resistor you need (e.g. 10k with at least 75V and 0.1W) the package will be automatically choosen The manufacturer's data is automatically added so that exactly that resistor will be ordered The value of the resistor will be automatically filled with the most relevant data To choose a resistor, you have to determine the maximum operating voltage and power dissipation that will be applied to that resistor in your design. With these two values you can choose the minimum package acc. to below table, which lists the maximum operating voltage and power dissipation for each package. Always try to use a package with a voltage rating of at least twice your max. operating voltage and always keep a little marging between your power dissipation and the maximum power dissipation of the package (although typically, resistors can be overloaded by a factor of five for a short time period, i.e. less than a second). Package Maximum Operating Voltage Maximum Power Dissipation 0402 ≤ 50V ≤ 62.5 mW 0603 ≤ 75V ≤ 100 mW 0805 ≤ 150V ≤ 125 mW 1206 ≤ 200V ≤ 250 mW 1210 ≤ 200V ≤ 500 mW 2512 ≤ 200V ≤ 1 W Note: If your project requires a very specific resistor (e.g. low tolerance, high voltage / power dissipation or E-24 upwards), then choose any of the predefined empty devices R(0402), R(0603), R(0805), R(1206), R(1210), or R(2512). Always set the attributes MF, MPN and VALUE for custom resistors! Never change the value of non-custom resistors!; LINE1: 270R ±1%; LINE2: 75V 0.1W; MF: YAGEO; MPN: RC0603FR-07270RL; POWER: 0.1W; RESISTANCE: 270R; TOLERANCE: ±1%; VOLTAGE: 75V
R102 = resistors:R(*?): Robotics Erlangen Resistor Library This library provides a list of predefined resistors with the following features: It is guaranteed that the resistor exists with the given value, voltage rating and package size If you choose the resistor you need (e.g. 10k with at least 75V and 0.1W) the package will be automatically choosen The manufacturer's data is automatically added so that exactly that resistor will be ordered The value of the resistor will be automatically filled with the most relevant data To choose a resistor, you have to determine the maximum operating voltage and power dissipation that will be applied to that resistor in your design. With these two values you can choose the minimum package acc. to below table, which lists the maximum operating voltage and power dissipation for each package. Always try to use a package with a voltage rating of at least twice your max. operating voltage and always keep a little marging between your power dissipation and the maximum power dissipation of the package (although typically, resistors can be overloaded by a factor of five for a short time period, i.e. less than a second). Package Maximum Operating Voltage Maximum Power Dissipation 0402 ≤ 50V ≤ 62.5 mW 0603 ≤ 75V ≤ 100 mW 0805 ≤ 150V ≤ 125 mW 1206 ≤ 200V ≤ 250 mW 1210 ≤ 200V ≤ 500 mW 2512 ≤ 200V ≤ 1 W Note: If your project requires a very specific resistor (e.g. low tolerance, high voltage / power dissipation or E-24 upwards), then choose any of the predefined empty devices R(0402), R(0603), R(0805), R(1206), R(1210), or R(2512). Always set the attributes MF, MPN and VALUE for custom resistors! Never change the value of non-custom resistors!; LINE1: 330k ±1%; LINE2: 500V 2W; MF: TE Connectivity / Holsworthy; MPN: CRGP2512F330K; POWER: 2W; RESISTANCE: 330k; TOLERANCE: ±1%; VOLTAGE: 500V
R103 = resistors:R(*?): Robotics Erlangen Resistor Library This library provides a list of predefined resistors with the following features: It is guaranteed that the resistor exists with the given value, voltage rating and package size If you choose the resistor you need (e.g. 10k with at least 75V and 0.1W) the package will be automatically choosen The manufacturer's data is automatically added so that exactly that resistor will be ordered The value of the resistor will be automatically filled with the most relevant data To choose a resistor, you have to determine the maximum operating voltage and power dissipation that will be applied to that resistor in your design. With these two values you can choose the minimum package acc. to below table, which lists the maximum operating voltage and power dissipation for each package. Always try to use a package with a voltage rating of at least twice your max. operating voltage and always keep a little marging between your power dissipation and the maximum power dissipation of the package (although typically, resistors can be overloaded by a factor of five for a short time period, i.e. less than a second). Package Maximum Operating Voltage Maximum Power Dissipation 0402 ≤ 50V ≤ 62.5 mW 0603 ≤ 75V ≤ 100 mW 0805 ≤ 150V ≤ 125 mW 1206 ≤ 200V ≤ 250 mW 1210 ≤ 200V ≤ 500 mW 2512 ≤ 200V ≤ 1 W Note: If your project requires a very specific resistor (e.g. low tolerance, high voltage / power dissipation or E-24 upwards), then choose any of the predefined empty devices R(0402), R(0603), R(0805), R(1206), R(1210), or R(2512). Always set the attributes MF, MPN and VALUE for custom resistors! Never change the value of non-custom resistors!; LINE1: 33k ±1%; LINE2: 500V 2W; MF: TE Connectivity / Holsworthy; MPN: CRGP2512F33K; POWER: 2W; RESISTANCE: 33k; TOLERANCE: 1%; VOLTAGE: 500V
R104 = resistors:R(*?): Robotics Erlangen Resistor Library This library provides a list of predefined resistors with the following features: It is guaranteed that the resistor exists with the given value, voltage rating and package size If you choose the resistor you need (e.g. 10k with at least 75V and 0.1W) the package will be automatically choosen The manufacturer's data is automatically added so that exactly that resistor will be ordered The value of the resistor will be automatically filled with the most relevant data To choose a resistor, you have to determine the maximum operating voltage and power dissipation that will be applied to that resistor in your design. With these two values you can choose the minimum package acc. to below table, which lists the maximum operating voltage and power dissipation for each package. Always try to use a package with a voltage rating of at least twice your max. operating voltage and always keep a little marging between your power dissipation and the maximum power dissipation of the package (although typically, resistors can be overloaded by a factor of five for a short time period, i.e. less than a second). Package Maximum Operating Voltage Maximum Power Dissipation 0402 ≤ 50V ≤ 62.5 mW 0603 ≤ 75V ≤ 100 mW 0805 ≤ 150V ≤ 125 mW 1206 ≤ 200V ≤ 250 mW 1210 ≤ 200V ≤ 500 mW 2512 ≤ 200V ≤ 1 W Note: If your project requires a very specific resistor (e.g. low tolerance, high voltage / power dissipation or E-24 upwards), then choose any of the predefined empty devices R(0402), R(0603), R(0805), R(1206), R(1210), or R(2512). Always set the attributes MF, MPN and VALUE for custom resistors! Never change the value of non-custom resistors!; LINE1: 470k ±5%; LINE2: 500V 1.5W; MF: Vishay / Dale; MPN: CRCW2512470KJNEGHP; POWER: 1.5W; RESISTANCE: 470k; TOLERANCE: ±5%; VOLTAGE: 500V
R105 = resistors:R(*?): Robotics Erlangen Resistor Library This library provides a list of predefined resistors with the following features: It is guaranteed that the resistor exists with the given value, voltage rating and package size If you choose the resistor you need (e.g. 10k with at least 75V and 0.1W) the package will be automatically choosen The manufacturer's data is automatically added so that exactly that resistor will be ordered The value of the resistor will be automatically filled with the most relevant data To choose a resistor, you have to determine the maximum operating voltage and power dissipation that will be applied to that resistor in your design. With these two values you can choose the minimum package acc. to below table, which lists the maximum operating voltage and power dissipation for each package. Always try to use a package with a voltage rating of at least twice your max. operating voltage and always keep a little marging between your power dissipation and the maximum power dissipation of the package (although typically, resistors can be overloaded by a factor of five for a short time period, i.e. less than a second). Package Maximum Operating Voltage Maximum Power Dissipation 0402 ≤ 50V ≤ 62.5 mW 0603 ≤ 75V ≤ 100 mW 0805 ≤ 150V ≤ 125 mW 1206 ≤ 200V ≤ 250 mW 1210 ≤ 200V ≤ 500 mW 2512 ≤ 200V ≤ 1 W Note: If your project requires a very specific resistor (e.g. low tolerance, high voltage / power dissipation or E-24 upwards), then choose any of the predefined empty devices R(0402), R(0603), R(0805), R(1206), R(1210), or R(2512). Always set the attributes MF, MPN and VALUE for custom resistors! Never change the value of non-custom resistors!; LINE1: 24k9 ±1%; LINE2: 75V 100mW; MF: YAGEO; MPN: RE0603FRE0724K9L; POWER: 100mW; RESISTANCE: 24k9; TOLERANCE: ±1%; VOLTAGE: 75V
R106 = resistors:R(*?): Robotics Erlangen Resistor Library This library provides a list of predefined resistors with the following features: It is guaranteed that the resistor exists with the given value, voltage rating and package size If you choose the resistor you need (e.g. 10k with at least 75V and 0.1W) the package will be automatically choosen The manufacturer's data is automatically added so that exactly that resistor will be ordered The value of the resistor will be automatically filled with the most relevant data To choose a resistor, you have to determine the maximum operating voltage and power dissipation that will be applied to that resistor in your design. With these two values you can choose the minimum package acc. to below table, which lists the maximum operating voltage and power dissipation for each package. Always try to use a package with a voltage rating of at least twice your max. operating voltage and always keep a little marging between your power dissipation and the maximum power dissipation of the package (although typically, resistors can be overloaded by a factor of five for a short time period, i.e. less than a second). Package Maximum Operating Voltage Maximum Power Dissipation 0402 ≤ 50V ≤ 62.5 mW 0603 ≤ 75V ≤ 100 mW 0805 ≤ 150V ≤ 125 mW 1206 ≤ 200V ≤ 250 mW 1210 ≤ 200V ≤ 500 mW 2512 ≤ 200V ≤ 1 W Note: If your project requires a very specific resistor (e.g. low tolerance, high voltage / power dissipation or E-24 upwards), then choose any of the predefined empty devices R(0402), R(0603), R(0805), R(1206), R(1210), or R(2512). Always set the attributes MF, MPN and VALUE for custom resistors! Never change the value of non-custom resistors!; LINE1: 4R7 ±1%; LINE2: 75V 0.1W; MF: YAGEO; MPN: RC0603FR-074R7L; POWER: 0.1W; RESISTANCE: 4R7; TOLERANCE: ±1%; VOLTAGE: 75V
R107 = resistors:R(*?): Robotics Erlangen Resistor Library This library provides a list of predefined resistors with the following features: It is guaranteed that the resistor exists with the given value, voltage rating and package size If you choose the resistor you need (e.g. 10k with at least 75V and 0.1W) the package will be automatically choosen The manufacturer's data is automatically added so that exactly that resistor will be ordered The value of the resistor will be automatically filled with the most relevant data To choose a resistor, you have to determine the maximum operating voltage and power dissipation that will be applied to that resistor in your design. With these two values you can choose the minimum package acc. to below table, which lists the maximum operating voltage and power dissipation for each package. Always try to use a package with a voltage rating of at least twice your max. operating voltage and always keep a little marging between your power dissipation and the maximum power dissipation of the package (although typically, resistors can be overloaded by a factor of five for a short time period, i.e. less than a second). Package Maximum Operating Voltage Maximum Power Dissipation 0402 ≤ 50V ≤ 62.5 mW 0603 ≤ 75V ≤ 100 mW 0805 ≤ 150V ≤ 125 mW 1206 ≤ 200V ≤ 250 mW 1210 ≤ 200V ≤ 500 mW 2512 ≤ 200V ≤ 1 W Note: If your project requires a very specific resistor (e.g. low tolerance, high voltage / power dissipation or E-24 upwards), then choose any of the predefined empty devices R(0402), R(0603), R(0805), R(1206), R(1210), or R(2512). Always set the attributes MF, MPN and VALUE for custom resistors! Never change the value of non-custom resistors!; LINE1: 249k ±1%; LINE2: 75V 100mW; MF: YAGEO; MPN: RC0603FR-07249KL; POWER: 100mW; RESISTANCE: 249k; TOLERANCE: ±1%; VOLTAGE: 75V
R108 = resistors:R(*?): Robotics Erlangen Resistor Library This library provides a list of predefined resistors with the following features: It is guaranteed that the resistor exists with the given value, voltage rating and package size If you choose the resistor you need (e.g. 10k with at least 75V and 0.1W) the package will be automatically choosen The manufacturer's data is automatically added so that exactly that resistor will be ordered The value of the resistor will be automatically filled with the most relevant data To choose a resistor, you have to determine the maximum operating voltage and power dissipation that will be applied to that resistor in your design. With these two values you can choose the minimum package acc. to below table, which lists the maximum operating voltage and power dissipation for each package. Always try to use a package with a voltage rating of at least twice your max. operating voltage and always keep a little marging between your power dissipation and the maximum power dissipation of the package (although typically, resistors can be overloaded by a factor of five for a short time period, i.e. less than a second). Package Maximum Operating Voltage Maximum Power Dissipation 0402 ≤ 50V ≤ 62.5 mW 0603 ≤ 75V ≤ 100 mW 0805 ≤ 150V ≤ 125 mW 1206 ≤ 200V ≤ 250 mW 1210 ≤ 200V ≤ 500 mW 2512 ≤ 200V ≤ 1 W Note: If your project requires a very specific resistor (e.g. low tolerance, high voltage / power dissipation or E-24 upwards), then choose any of the predefined empty devices R(0402), R(0603), R(0805), R(1206), R(1210), or R(2512). Always set the attributes MF, MPN and VALUE for custom resistors! Never change the value of non-custom resistors!; LINE1: 51k1 ±1%; LINE2: 75V 100mW; MF: YAGEO; MPN: RC0603FR-0751K1L; POWER: 100mW; RESISTANCE: 51k1; TOLERANCE: ±1%; VOLTAGE: 75V
R109 = resistors:R(*?): Robotics Erlangen Resistor Library This library provides a list of predefined resistors with the following features: It is guaranteed that the resistor exists with the given value, voltage rating and package size If you choose the resistor you need (e.g. 10k with at least 75V and 0.1W) the package will be automatically choosen The manufacturer's data is automatically added so that exactly that resistor will be ordered The value of the resistor will be automatically filled with the most relevant data To choose a resistor, you have to determine the maximum operating voltage and power dissipation that will be applied to that resistor in your design. With these two values you can choose the minimum package acc. to below table, which lists the maximum operating voltage and power dissipation for each package. Always try to use a package with a voltage rating of at least twice your max. operating voltage and always keep a little marging between your power dissipation and the maximum power dissipation of the package (although typically, resistors can be overloaded by a factor of five for a short time period, i.e. less than a second). Package Maximum Operating Voltage Maximum Power Dissipation 0402 ≤ 50V ≤ 62.5 mW 0603 ≤ 75V ≤ 100 mW 0805 ≤ 150V ≤ 125 mW 1206 ≤ 200V ≤ 250 mW 1210 ≤ 200V ≤ 500 mW 2512 ≤ 200V ≤ 1 W Note: If your project requires a very specific resistor (e.g. low tolerance, high voltage / power dissipation or E-24 upwards), then choose any of the predefined empty devices R(0402), R(0603), R(0805), R(1206), R(1210), or R(2512). Always set the attributes MF, MPN and VALUE for custom resistors! Never change the value of non-custom resistors!; LINE1: 6k04 ±1%; LINE2: 75V 100mW; MF: YAGEO; MPN: AC0603FR-136K04L; POWER: 100mW; RESISTANCE: 6k04; TOLERANCE: ±1%; VOLTAGE: 75V
R110 = resistors:R(*?): Robotics Erlangen Resistor Library This library provides a list of predefined resistors with the following features: It is guaranteed that the resistor exists with the given value, voltage rating and package size If you choose the resistor you need (e.g. 10k with at least 75V and 0.1W) the package will be automatically choosen The manufacturer's data is automatically added so that exactly that resistor will be ordered The value of the resistor will be automatically filled with the most relevant data To choose a resistor, you have to determine the maximum operating voltage and power dissipation that will be applied to that resistor in your design. With these two values you can choose the minimum package acc. to below table, which lists the maximum operating voltage and power dissipation for each package. Always try to use a package with a voltage rating of at least twice your max. operating voltage and always keep a little marging between your power dissipation and the maximum power dissipation of the package (although typically, resistors can be overloaded by a factor of five for a short time period, i.e. less than a second). Package Maximum Operating Voltage Maximum Power Dissipation 0402 ≤ 50V ≤ 62.5 mW 0603 ≤ 75V ≤ 100 mW 0805 ≤ 150V ≤ 125 mW 1206 ≤ 200V ≤ 250 mW 1210 ≤ 200V ≤ 500 mW 2512 ≤ 200V ≤ 1 W Note: If your project requires a very specific resistor (e.g. low tolerance, high voltage / power dissipation or E-24 upwards), then choose any of the predefined empty devices R(0402), R(0603), R(0805), R(1206), R(1210), or R(2512). Always set the attributes MF, MPN and VALUE for custom resistors! Never change the value of non-custom resistors!; LINE1: 15m ±1%; LINE2: 1W; MF: Panasonic; MPN: ERJ-8BWFR015V; POWER: 1W; RESISTANCE: 15m; TOLERANCE: ±1%
R111 = resistors:R(*?): Robotics Erlangen Resistor Library This library provides a list of predefined resistors with the following features: It is guaranteed that the resistor exists with the given value, voltage rating and package size If you choose the resistor you need (e.g. 10k with at least 75V and 0.1W) the package will be automatically choosen The manufacturer's data is automatically added so that exactly that resistor will be ordered The value of the resistor will be automatically filled with the most relevant data To choose a resistor, you have to determine the maximum operating voltage and power dissipation that will be applied to that resistor in your design. With these two values you can choose the minimum package acc. to below table, which lists the maximum operating voltage and power dissipation for each package. Always try to use a package with a voltage rating of at least twice your max. operating voltage and always keep a little marging between your power dissipation and the maximum power dissipation of the package (although typically, resistors can be overloaded by a factor of five for a short time period, i.e. less than a second). Package Maximum Operating Voltage Maximum Power Dissipation 0402 ≤ 50V ≤ 62.5 mW 0603 ≤ 75V ≤ 100 mW 0805 ≤ 150V ≤ 125 mW 1206 ≤ 200V ≤ 250 mW 1210 ≤ 200V ≤ 500 mW 2512 ≤ 200V ≤ 1 W Note: If your project requires a very specific resistor (e.g. low tolerance, high voltage / power dissipation or E-24 upwards), then choose any of the predefined empty devices R(0402), R(0603), R(0805), R(1206), R(1210), or R(2512). Always set the attributes MF, MPN and VALUE for custom resistors! Never change the value of non-custom resistors!; LINE1: 100k ±1%; LINE2: 200V 0.25W; MF: YAGEO; MPN: RC1206FR-07100KL; POWER: 0.25W; RESISTANCE: 100k; TOLERANCE: ±1%; VOLTAGE: 200V
R112 = resistors:R(*?): Robotics Erlangen Resistor Library This library provides a list of predefined resistors with the following features: It is guaranteed that the resistor exists with the given value, voltage rating and package size If you choose the resistor you need (e.g. 10k with at least 75V and 0.1W) the package will be automatically choosen The manufacturer's data is automatically added so that exactly that resistor will be ordered The value of the resistor will be automatically filled with the most relevant data To choose a resistor, you have to determine the maximum operating voltage and power dissipation that will be applied to that resistor in your design. With these two values you can choose the minimum package acc. to below table, which lists the maximum operating voltage and power dissipation for each package. Always try to use a package with a voltage rating of at least twice your max. operating voltage and always keep a little marging between your power dissipation and the maximum power dissipation of the package (although typically, resistors can be overloaded by a factor of five for a short time period, i.e. less than a second). Package Maximum Operating Voltage Maximum Power Dissipation 0402 ≤ 50V ≤ 62.5 mW 0603 ≤ 75V ≤ 100 mW 0805 ≤ 150V ≤ 125 mW 1206 ≤ 200V ≤ 250 mW 1210 ≤ 200V ≤ 500 mW 2512 ≤ 200V ≤ 1 W Note: If your project requires a very specific resistor (e.g. low tolerance, high voltage / power dissipation or E-24 upwards), then choose any of the predefined empty devices R(0402), R(0603), R(0805), R(1206), R(1210), or R(2512). Always set the attributes MF, MPN and VALUE for custom resistors! Never change the value of non-custom resistors!; LINE1: n.c.; RESISTANCE: n.c.
R201 R202 = resistors:R(*?): Robotics Erlangen Resistor Library This library provides a list of predefined resistors with the following features: It is guaranteed that the resistor exists with the given value, voltage rating and package size If you choose the resistor you need (e.g. 10k with at least 75V and 0.1W) the package will be automatically choosen The manufacturer's data is automatically added so that exactly that resistor will be ordered The value of the resistor will be automatically filled with the most relevant data To choose a resistor, you have to determine the maximum operating voltage and power dissipation that will be applied to that resistor in your design. With these two values you can choose the minimum package acc. to below table, which lists the maximum operating voltage and power dissipation for each package. Always try to use a package with a voltage rating of at least twice your max. operating voltage and always keep a little marging between your power dissipation and the maximum power dissipation of the package (although typically, resistors can be overloaded by a factor of five for a short time period, i.e. less than a second). Package Maximum Operating Voltage Maximum Power Dissipation 0402 ≤ 50V ≤ 62.5 mW 0603 ≤ 75V ≤ 100 mW 0805 ≤ 150V ≤ 125 mW 1206 ≤ 200V ≤ 250 mW 1210 ≤ 200V ≤ 500 mW 2512 ≤ 200V ≤ 1 W Note: If your project requires a very specific resistor (e.g. low tolerance, high voltage / power dissipation or E-24 upwards), then choose any of the predefined empty devices R(0402), R(0603), R(0805), R(1206), R(1210), or R(2512). Always set the attributes MF, MPN and VALUE for custom resistors! Never change the value of non-custom resistors!; LINE1: 22R ±1%; LINE2: 75V 0.1W; MF: YAGEO; MPN: RC0603FR-0722RL; POWER: 0.1W; RESISTANCE: 22R; TOLERANCE: ±1%; VOLTAGE: 75V
R203 R204 = resistors:R(*?): Robotics Erlangen Resistor Library This library provides a list of predefined resistors with the following features: It is guaranteed that the resistor exists with the given value, voltage rating and package size If you choose the resistor you need (e.g. 10k with at least 75V and 0.1W) the package will be automatically choosen The manufacturer's data is automatically added so that exactly that resistor will be ordered The value of the resistor will be automatically filled with the most relevant data To choose a resistor, you have to determine the maximum operating voltage and power dissipation that will be applied to that resistor in your design. With these two values you can choose the minimum package acc. to below table, which lists the maximum operating voltage and power dissipation for each package. Always try to use a package with a voltage rating of at least twice your max. operating voltage and always keep a little marging between your power dissipation and the maximum power dissipation of the package (although typically, resistors can be overloaded by a factor of five for a short time period, i.e. less than a second). Package Maximum Operating Voltage Maximum Power Dissipation 0402 ≤ 50V ≤ 62.5 mW 0603 ≤ 75V ≤ 100 mW 0805 ≤ 150V ≤ 125 mW 1206 ≤ 200V ≤ 250 mW 1210 ≤ 200V ≤ 500 mW 2512 ≤ 200V ≤ 1 W Note: If your project requires a very specific resistor (e.g. low tolerance, high voltage / power dissipation or E-24 upwards), then choose any of the predefined empty devices R(0402), R(0603), R(0805), R(1206), R(1210), or R(2512). Always set the attributes MF, MPN and VALUE for custom resistors! Never change the value of non-custom resistors!; LINE1: 1k ±1%; LINE2: 75V 0.1W; MF: YAGEO; MPN: RC0603FR-071KL; POWER: 0.1W; RESISTANCE: 1k; TOLERANCE: ±1%; VOLTAGE: 75V
R205 R206 = resistors:R(*?): Robotics Erlangen Resistor Library This library provides a list of predefined resistors with the following features: It is guaranteed that the resistor exists with the given value, voltage rating and package size If you choose the resistor you need (e.g. 10k with at least 75V and 0.1W) the package will be automatically choosen The manufacturer's data is automatically added so that exactly that resistor will be ordered The value of the resistor will be automatically filled with the most relevant data To choose a resistor, you have to determine the maximum operating voltage and power dissipation that will be applied to that resistor in your design. With these two values you can choose the minimum package acc. to below table, which lists the maximum operating voltage and power dissipation for each package. Always try to use a package with a voltage rating of at least twice your max. operating voltage and always keep a little marging between your power dissipation and the maximum power dissipation of the package (although typically, resistors can be overloaded by a factor of five for a short time period, i.e. less than a second). Package Maximum Operating Voltage Maximum Power Dissipation 0402 ≤ 50V ≤ 62.5 mW 0603 ≤ 75V ≤ 100 mW 0805 ≤ 150V ≤ 125 mW 1206 ≤ 200V ≤ 250 mW 1210 ≤ 200V ≤ 500 mW 2512 ≤ 200V ≤ 1 W Note: If your project requires a very specific resistor (e.g. low tolerance, high voltage / power dissipation or E-24 upwards), then choose any of the predefined empty devices R(0402), R(0603), R(0805), R(1206), R(1210), or R(2512). Always set the attributes MF, MPN and VALUE for custom resistors! Never change the value of non-custom resistors!; LINE1: 1k5 ±1%; LINE2: 75V 0.1W; MF: YAGEO; MPN: RC0603FR-071K5L; POWER: 0.1W; RESISTANCE: 1k5; TOLERANCE: ±1%; VOLTAGE: 75V
R207 R209 R213 R214 = resistors:R(*?): Robotics Erlangen Resistor Library This library provides a list of predefined resistors with the following features: It is guaranteed that the resistor exists with the given value, voltage rating and package size If you choose the resistor you need (e.g. 10k with at least 75V and 0.1W) the package will be automatically choosen The manufacturer's data is automatically added so that exactly that resistor will be ordered The value of the resistor will be automatically filled with the most relevant data To choose a resistor, you have to determine the maximum operating voltage and power dissipation that will be applied to that resistor in your design. With these two values you can choose the minimum package acc. to below table, which lists the maximum operating voltage and power dissipation for each package. Always try to use a package with a voltage rating of at least twice your max. operating voltage and always keep a little marging between your power dissipation and the maximum power dissipation of the package (although typically, resistors can be overloaded by a factor of five for a short time period, i.e. less than a second). Package Maximum Operating Voltage Maximum Power Dissipation 0402 ≤ 50V ≤ 62.5 mW 0603 ≤ 75V ≤ 100 mW 0805 ≤ 150V ≤ 125 mW 1206 ≤ 200V ≤ 250 mW 1210 ≤ 200V ≤ 500 mW 2512 ≤ 200V ≤ 1 W Note: If your project requires a very specific resistor (e.g. low tolerance, high voltage / power dissipation or E-24 upwards), then choose any of the predefined empty devices R(0402), R(0603), R(0805), R(1206), R(1210), or R(2512). Always set the attributes MF, MPN and VALUE for custom resistors! Never change the value of non-custom resistors!; LINE1: 0R ±1%; LINE2: 75V 0.1W; MF: YAGEO; MPN: RC0603FR-070RL; POWER: 0.1W; RESISTANCE: 0R; TOLERANCE: ±1%; VOLTAGE: 75V
R208 R210 = resistors:R(*?): Robotics Erlangen Resistor Library This library provides a list of predefined resistors with the following features: It is guaranteed that the resistor exists with the given value, voltage rating and package size If you choose the resistor you need (e.g. 10k with at least 75V and 0.1W) the package will be automatically choosen The manufacturer's data is automatically added so that exactly that resistor will be ordered The value of the resistor will be automatically filled with the most relevant data To choose a resistor, you have to determine the maximum operating voltage and power dissipation that will be applied to that resistor in your design. With these two values you can choose the minimum package acc. to below table, which lists the maximum operating voltage and power dissipation for each package. Always try to use a package with a voltage rating of at least twice your max. operating voltage and always keep a little marging between your power dissipation and the maximum power dissipation of the package (although typically, resistors can be overloaded by a factor of five for a short time period, i.e. less than a second). Package Maximum Operating Voltage Maximum Power Dissipation 0402 ≤ 50V ≤ 62.5 mW 0603 ≤ 75V ≤ 100 mW 0805 ≤ 150V ≤ 125 mW 1206 ≤ 200V ≤ 250 mW 1210 ≤ 200V ≤ 500 mW 2512 ≤ 200V ≤ 1 W Note: If your project requires a very specific resistor (e.g. low tolerance, high voltage / power dissipation or E-24 upwards), then choose any of the predefined empty devices R(0402), R(0603), R(0805), R(1206), R(1210), or R(2512). Always set the attributes MF, MPN and VALUE for custom resistors! Never change the value of non-custom resistors!; LINE1: 3R3 ±1%; LINE2: 75V 0.1W; MF: YAGEO; MPN: RC0603FR-073R3L; POWER: 0.1W; RESISTANCE: 3R3; TOLERANCE: ±1%; VOLTAGE: 75V
R211 R212 = kicker:R-EU_; MF: TE Connectivity / Holsworthy; MPN: 35603R3JT
R301 R303 = resistors:R(*?): Robotics Erlangen Resistor Library This library provides a list of predefined resistors with the following features: It is guaranteed that the resistor exists with the given value, voltage rating and package size If you choose the resistor you need (e.g. 10k with at least 75V and 0.1W) the package will be automatically choosen The manufacturer's data is automatically added so that exactly that resistor will be ordered The value of the resistor will be automatically filled with the most relevant data To choose a resistor, you have to determine the maximum operating voltage and power dissipation that will be applied to that resistor in your design. With these two values you can choose the minimum package acc. to below table, which lists the maximum operating voltage and power dissipation for each package. Always try to use a package with a voltage rating of at least twice your max. operating voltage and always keep a little marging between your power dissipation and the maximum power dissipation of the package (although typically, resistors can be overloaded by a factor of five for a short time period, i.e. less than a second). Package Maximum Operating Voltage Maximum Power Dissipation 0402 ≤ 50V ≤ 62.5 mW 0603 ≤ 75V ≤ 100 mW 0805 ≤ 150V ≤ 125 mW 1206 ≤ 200V ≤ 250 mW 1210 ≤ 200V ≤ 500 mW 2512 ≤ 200V ≤ 1 W Note: If your project requires a very specific resistor (e.g. low tolerance, high voltage / power dissipation or E-24 upwards), then choose any of the predefined empty devices R(0402), R(0603), R(0805), R(1206), R(1210), or R(2512). Always set the attributes MF, MPN and VALUE for custom resistors! Never change the value of non-custom resistors!; LINE1: 150R ±1%; LINE2: 75V 0.1W; MF: YAGEO; MPN: RC0603FR-07150RL; POWER: 0.1W; RESISTANCE: 150R; TOLERANCE: ±1%; VOLTAGE: 75V
R302 = resistors:R(*?): Robotics Erlangen Resistor Library This library provides a list of predefined resistors with the following features: It is guaranteed that the resistor exists with the given value, voltage rating and package size If you choose the resistor you need (e.g. 10k with at least 75V and 0.1W) the package will be automatically choosen The manufacturer's data is automatically added so that exactly that resistor will be ordered The value of the resistor will be automatically filled with the most relevant data To choose a resistor, you have to determine the maximum operating voltage and power dissipation that will be applied to that resistor in your design. With these two values you can choose the minimum package acc. to below table, which lists the maximum operating voltage and power dissipation for each package. Always try to use a package with a voltage rating of at least twice your max. operating voltage and always keep a little marging between your power dissipation and the maximum power dissipation of the package (although typically, resistors can be overloaded by a factor of five for a short time period, i.e. less than a second). Package Maximum Operating Voltage Maximum Power Dissipation 0402 ≤ 50V ≤ 62.5 mW 0603 ≤ 75V ≤ 100 mW 0805 ≤ 150V ≤ 125 mW 1206 ≤ 200V ≤ 250 mW 1210 ≤ 200V ≤ 500 mW 2512 ≤ 200V ≤ 1 W Note: If your project requires a very specific resistor (e.g. low tolerance, high voltage / power dissipation or E-24 upwards), then choose any of the predefined empty devices R(0402), R(0603), R(0805), R(1206), R(1210), or R(2512). Always set the attributes MF, MPN and VALUE for custom resistors! Never change the value of non-custom resistors!; LINE1: 1M ±5%; LINE2: 200V 0.75W; MF: YAGEO; MPN: RC2010JK-071ML; POWER: 0.75W; RESISTANCE: 1M; TOLERANCE: ±5%; VOLTAGE: 200V
R304 = resistors:R(*?): Robotics Erlangen Resistor Library This library provides a list of predefined resistors with the following features: It is guaranteed that the resistor exists with the given value, voltage rating and package size If you choose the resistor you need (e.g. 10k with at least 75V and 0.1W) the package will be automatically choosen The manufacturer's data is automatically added so that exactly that resistor will be ordered The value of the resistor will be automatically filled with the most relevant data To choose a resistor, you have to determine the maximum operating voltage and power dissipation that will be applied to that resistor in your design. With these two values you can choose the minimum package acc. to below table, which lists the maximum operating voltage and power dissipation for each package. Always try to use a package with a voltage rating of at least twice your max. operating voltage and always keep a little marging between your power dissipation and the maximum power dissipation of the package (although typically, resistors can be overloaded by a factor of five for a short time period, i.e. less than a second). Package Maximum Operating Voltage Maximum Power Dissipation 0402 ≤ 50V ≤ 62.5 mW 0603 ≤ 75V ≤ 100 mW 0805 ≤ 150V ≤ 125 mW 1206 ≤ 200V ≤ 250 mW 1210 ≤ 200V ≤ 500 mW 2512 ≤ 200V ≤ 1 W Note: If your project requires a very specific resistor (e.g. low tolerance, high voltage / power dissipation or E-24 upwards), then choose any of the predefined empty devices R(0402), R(0603), R(0805), R(1206), R(1210), or R(2512). Always set the attributes MF, MPN and VALUE for custom resistors! Never change the value of non-custom resistors!; LINE1: 10k ±1%; LINE2: 75V 0.1W; MF: YAGEO; MPN: RC0603FR-0710KL; POWER: 0.1W; RESISTANCE: 10k; TOLERANCE: ±1%; VOLTAGE: 75V
R305-R309 = resistors:R(*?): Robotics Erlangen Resistor Library This library provides a list of predefined resistors with the following features: It is guaranteed that the resistor exists with the given value, voltage rating and package size If you choose the resistor you need (e.g. 10k with at least 75V and 0.1W) the package will be automatically choosen The manufacturer's data is automatically added so that exactly that resistor will be ordered The value of the resistor will be automatically filled with the most relevant data To choose a resistor, you have to determine the maximum operating voltage and power dissipation that will be applied to that resistor in your design. With these two values you can choose the minimum package acc. to below table, which lists the maximum operating voltage and power dissipation for each package. Always try to use a package with a voltage rating of at least twice your max. operating voltage and always keep a little marging between your power dissipation and the maximum power dissipation of the package (although typically, resistors can be overloaded by a factor of five for a short time period, i.e. less than a second). Package Maximum Operating Voltage Maximum Power Dissipation 0402 ≤ 50V ≤ 62.5 mW 0603 ≤ 75V ≤ 100 mW 0805 ≤ 150V ≤ 125 mW 1206 ≤ 200V ≤ 250 mW 1210 ≤ 200V ≤ 500 mW 2512 ≤ 200V ≤ 1 W Note: If your project requires a very specific resistor (e.g. low tolerance, high voltage / power dissipation or E-24 upwards), then choose any of the predefined empty devices R(0402), R(0603), R(0805), R(1206), R(1210), or R(2512). Always set the attributes MF, MPN and VALUE for custom resistors! Never change the value of non-custom resistors!; LINE1: 100R ±1%; LINE2: 75V 0.1W; MF: YAGEO; MPN: RC0603FR-07100RL; POWER: 0.1W; RESISTANCE: 100R; TOLERANCE: ±1%; VOLTAGE: 75V
T101 = kicker:WE_FB_EFD25; MF: Würth Elektronik; MPN: 750310988
U101 = kicker:LT3748: LT3748 - 100V Isolated Flyback Controller Features 5V to 100V Input Voltage Range 1.9A Average Gate Drive Source and Sink Current Boundary Mode Operation No Transformer Third Winding or Opto-Isolator Required for Regulation Primary-Side Winding Feedback Load Regulation VOUT Set with Two External Resistors INTVCC Pin for Control of Gate Driver Voltage Programmable Soft Start Programmable Undervoltage Lockout Available in MSOP Package; MF: Analog Devices; MOUSER: LT3748IMS#TRPBF; MPN: LT3748IMS#PBF
U201 U202 = kicker:UCC27532; MF: Texas Instruments; MPN: UCC27532DBVT
U203 = kicker:NCP785AH*T1G; MF: ON Semiconductor; MOUSER: 863-NCP785AH33T1G; MPN: NCP785AH33T1G
U204 = kicker:NCP785AH*T1G; MF: ON Semiconductor; MOUSER: 863-NCP785AH150T1G; MPN: NCP785AH150T1G
U301 = kicker:AMC1304L05DW; MF: Texas Instruments; MPN: AMC1304L05DW
Y301 = kicker:DSC1123?*; MF: Microchip Technology; MOUSER: 579-DSC1123CI2020; MPN: DSC1123CI2-020.0000

## Net classes
0 LV: 0V - 30V: width 0.254 mm, drill 0.3 mm, clearance 0.2 mm
1 LV: 0V - 100V: width 0.254 mm, drill 0.3 mm, clearance 0.6 mm to class 0, clearance 0.2 mm
2 HV: 0V - 30V: width 0.254 mm, drill 0.3 mm, clearance 1.25 mm to class 0, clearance 1.25 mm to class 1, clearance 0.2 mm
3 HV: 0V - 250V: width 0.254 mm, drill 0.3 mm, clearance 1.25 mm to class 0, clearance 1.25 mm to class 1, clearance 1.25 mm to class 2, clearance 0.2 mm
4 HV: 250V: width 0.254 mm, drill 0.3 mm, clearance 1.25 mm to class 0, clearance 1.25 mm to class 1, clearance 1.25 mm to class 2, clearance 1.25 mm to class 3, clearance 0.2 mm

## Board
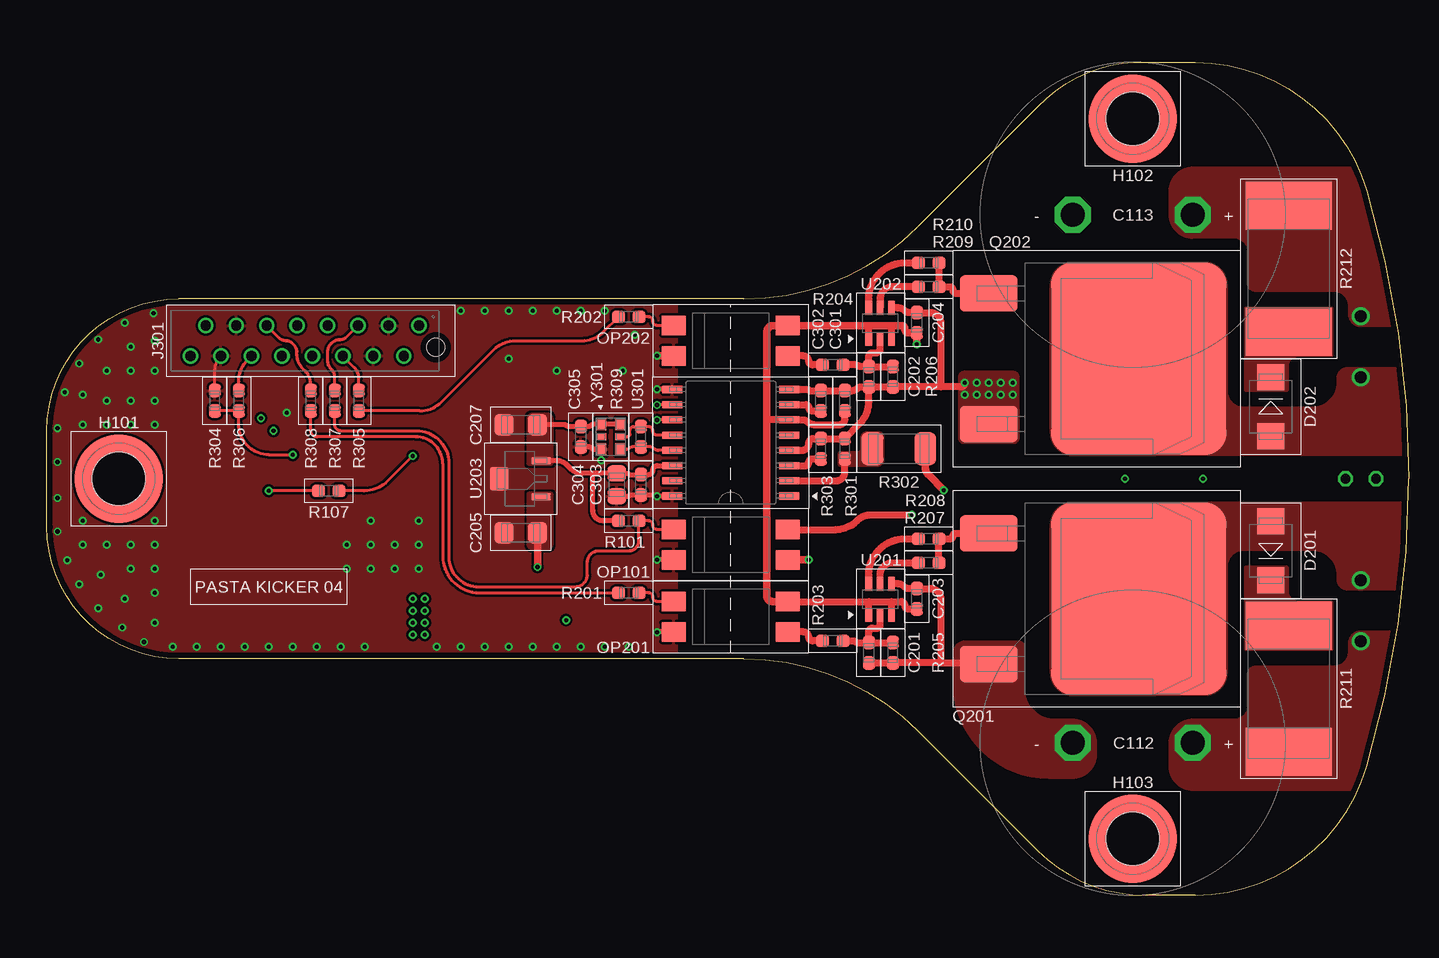
[diagram p3: board, top side]
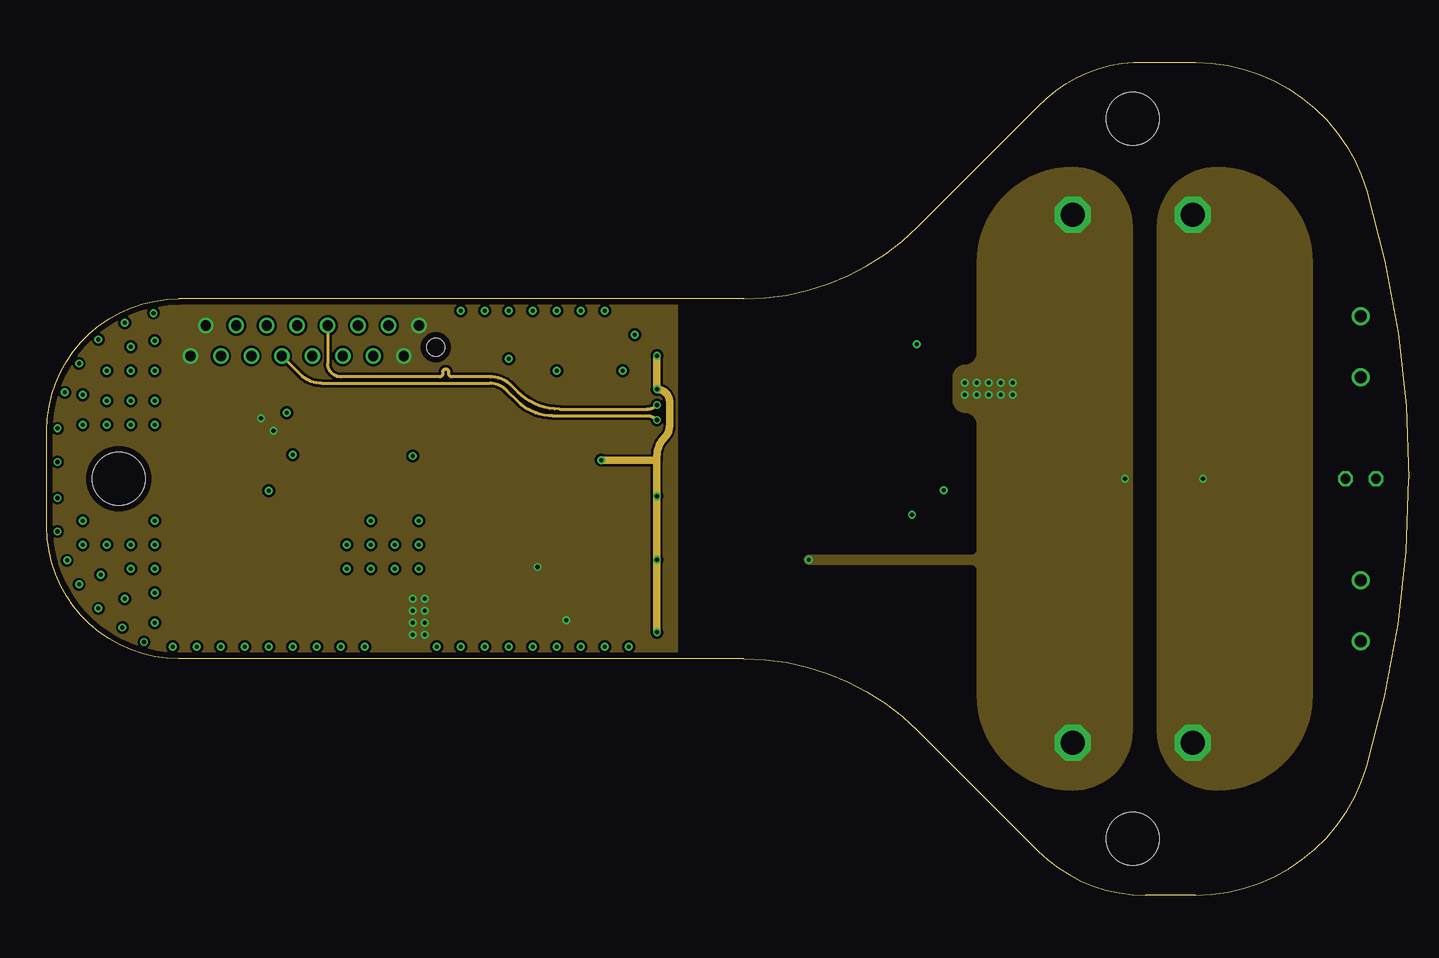
[diagram p4: board, inner layer Route2]
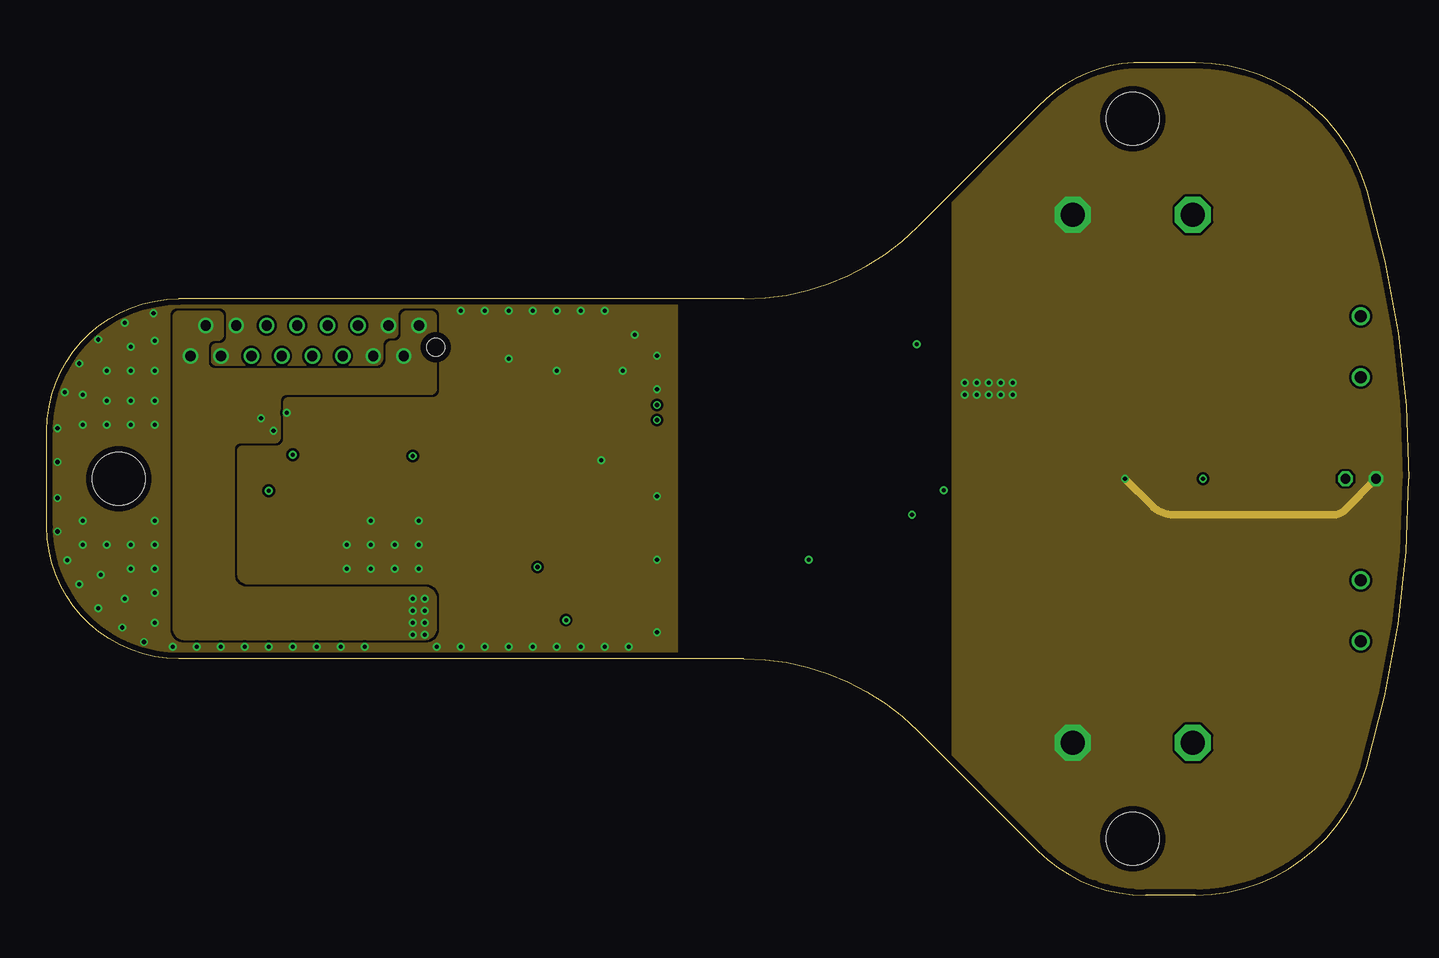
[diagram p5: board, inner layer Route15]
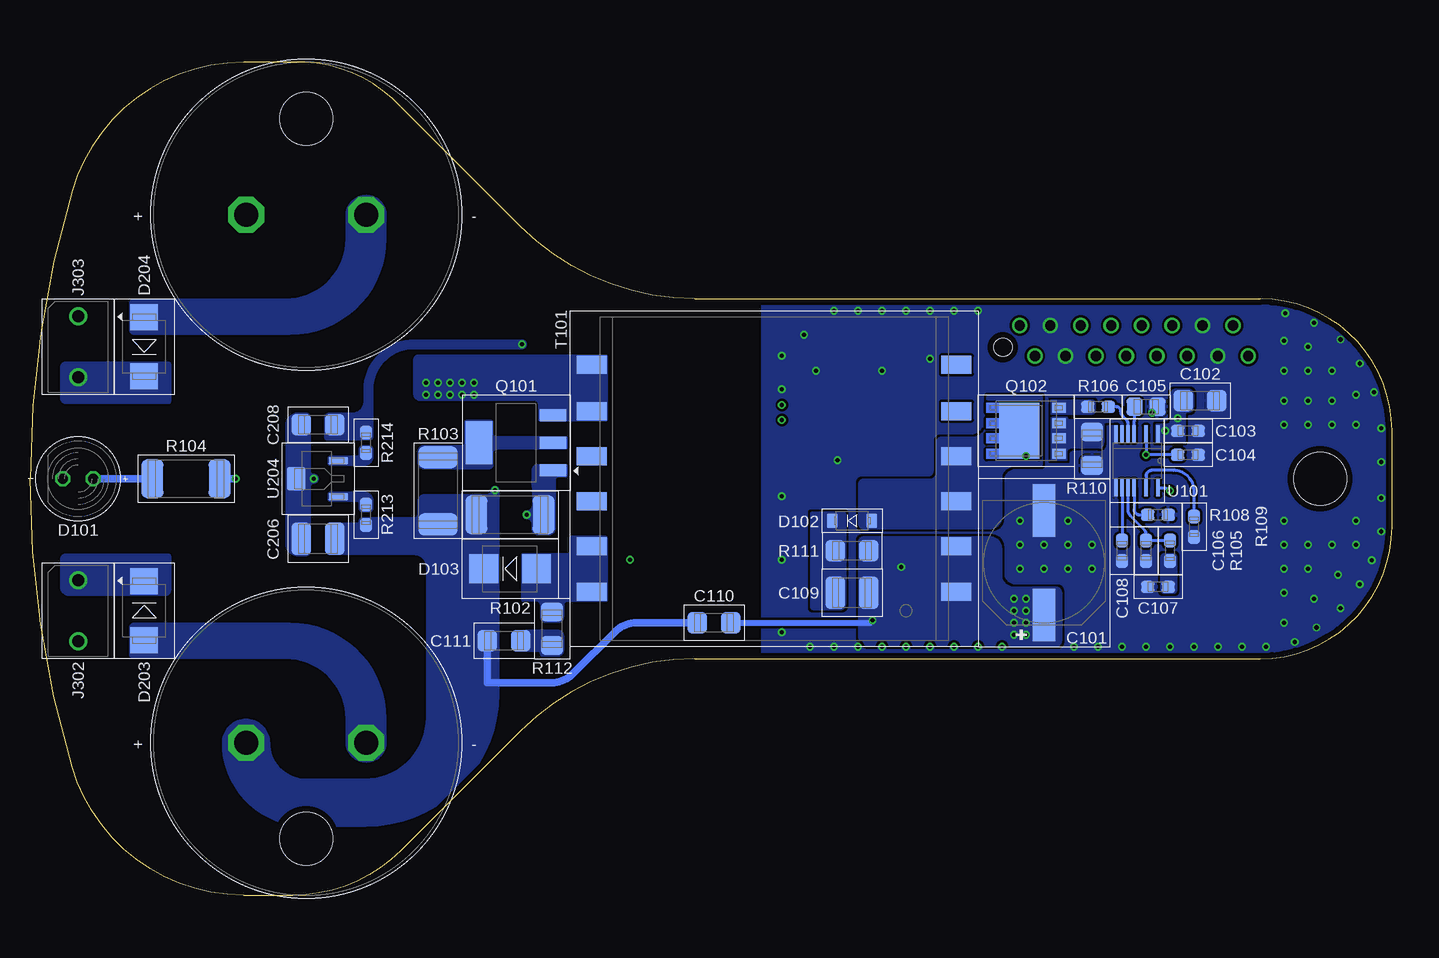
[diagram p6: board, bottom side, seen from below]

Size 113.5 x 69.4 mm. Coordinates in mm from the lower left corner, seen from the top.
Outline: 82.6,3.7 arc45 91.6,0 95.7,0 arc74 110,10.7 arc16 113.5,34.7 arc16 110,58.7 arc74 95.7,69.4 90.6,69.4 arc45 82.6,65.7 72.6,55.7 arc-45 58.1,49.7 11,49.7 arc90 0,38.7 0,30.7 arc90 11,19.7 58.1,19.7 arc-45 72.6,13.7 82.6,3.7
Copper layers (1+2*15+16): Top 0.035mm / dielectric 0.175mm / Route2 0.035mm / dielectric 1.13mm / Route15 0.035mm / dielectric 0.175mm / Bottom 0.035mm
Design rules "kicker": minimum track width 6mil, minimum drill 0.3mm, track to track 6mil, track to pad 6mil, pad to pad 6mil, via to via 6mil, smd to smd 0mil, copper to edge 0.5mm, drill to drill 6mil, minimum pad ring 0.15mm, minimum via ring 0.15mm, stop-mask expansion 0.05mm, vias tented up to drill 0.45mm, thermal gap 0.2mm

### Footprints (pad centres in the part's own frame; a part is rotated, then mirrored left to right if it is on the bottom)
WCAP-PSLC_10X12.4(DXL) = smd 4.4 x 1.9: 1 4.35,0; 2 -4.35,0
C1206 = smd 1.6 x 1.8: 1 -1.4,0; 2 1.4,0
C0603 = smd 1.1 x 1: 1 -0.85,0; 2 0.85,0
C0805 = smd 1.3 x 1.5: 1 -0.95,0; 2 0.95,0
C1210 = smd 1.6 x 2.7: 1 -1.4,0; 2 1.4,0
ESMQ251VSN102MQ45S = drill 2 octagon: N 5,0; P -5,0
LED5MM = drill 0.813 octagon: A -1.27,0; K 1.27,0
SOD-123 = smd 0.91 x 1.22: A 1.635,0; C -1.635,0
SMB = smd 2.4 x 2.4: A 2.2,0; C -2.2,0
DO-214 = smd 2.16 x 2.26: A 2.45,0; C -2.45,0
9774***360 = smd 7.4 x 7.4: 1 0,0 | hole 4.4: 0,0
690367181672 = drill 0.85: 1 9.525,1.27; 2 8.255,-1.27; 3 6.985,1.27; 4 5.715,-1.27; 5 4.445,1.27; 6 3.175,-1.27; 7 1.905,1.27; 8 0.635,-1.27; 9 -0.635,1.27; 10 -1.905,-1.27; 11 -3.175,1.27; 12 -4.445,-1.27; 13 -5.715,1.27; 14 -6.985,-1.27; 15 -8.255,1.27; 16 -9.525,-1.27 | hole 1.5: 10.925,-0.53
66100311622* = drill 1: 1 2.54,0; 2 -2.54,0
DIL4-SMD = smd 1.6 x 2: 1 -1.27,-4.77; 2 1.27,-4.77; 3 1.27,4.77; 4 -1.27,4.77
SOT223 = smd 1 x 2.2: 1 -2.311,-3.099; 2 0,-3.099; 3 2.311,-3.099 | smd 3.6 x 2.2: 4 0,3.099
SOP-8 = smd 0.85 x 1.1: 1 -1.905,-2.75; 2 -0.635,-2.75; 3 0.635,-2.75; 4 1.905,-2.75 | smd 4.7 x 3.35: 5 0,0.575
TO-268HV = smd 4.8 x 3: 1 0,5.45; 2 0,-5.45 | smd 14.6 x 16: 3 -12.5,0
R0603 = smd 1.1 x 1: 1 -0.85,0; 2 0.85,0
R2512 = smd 1.8 x 3.2: 1 -2.8,0; 2 2.8,0
R1206 = smd 1.6 x 1.8: 1 -1.4,0; 2 1.4,0
R4527 = smd 4 x 7.2: 1 -5.25,0; 2 5.25,0
R2010 = smd 1.8 x 2.7: 1 -2.2,0; 2 2.2,0
WE_FB_EFD25 = smd 2.5 x 1.5: 1 15.2,-9.4; 2 15.2,-5.64; 3 15.2,-1.88; 4 15.2,1.88; 5 15.2,5.64; 6 15.2,9.5; 7 -15.2,9.5; 8 -15.2,5.64; 9 -15.2,1.88; 10 -15.2,-1.88; 11 -15.2,-5.64; 12 -15.2,-9.4
MSOP16 = smd 0.3 x 1.4: 1 -2,-2.25; 3 -1,-2.25; 5 0,-2.25; 6 0.5,-2.25; 7 1,-2.25; 8 1.5,-2.25; 9 1.5,2.25; 10 1,2.25; 11 0.5,2.25; 12 0,2.25; 14 -1,2.25; 16 -2,2.25
SOT23-6 = smd 1.1 x 0.6: P1 -1.35,1; P2 -1.35,0.05; P3 -1.35,-0.9; P4 1.25,-0.9; P5 1.25,0.05; P6 1.25,1
NCP785AH*T1G = smd 0.6 x 1.6: 1 -1.5,-0.2; 3 1.5,-0.2 | smd 2 x 1.57: 2 0,3.3
DW0016B_HV = smd 1.65 x 0.6: 1 -4.875,4.445; 2 -4.875,3.175; 3 -4.875,1.905; 4 -4.875,0.635; 5 -4.875,-0.635; 6 -4.875,-1.905; 7 -4.875,-3.175; 8 -4.875,-4.445; 9 4.875,-4.445; 10 4.875,-3.175; 11 4.875,-1.905; 12 4.875,-0.635; 13 4.875,0.635; 14 4.875,1.905; 15 4.875,3.175; 16 4.875,4.445
DSC11X3 = smd 1 x 0.85: P1 -1.05,-0.8; P3 1.05,-0.8; P4 1.05,0.8; P6 -1.05,0.8 | smd 0.6 x 0.85: P2 0,-0.8; P5 0,0.8

### Placement (x,y rotation side)
C101  29,27.7 270 bottom
C102  16,41.2 0 bottom
C103  17,38.7 0 bottom
C104  17,36.7 0 bottom
C105  20.5,40.7 0 bottom
C106  20.5,28.7 270 bottom
C107  19.5,25.7 180 bottom
C108  22.5,28.7 270 bottom
C109  45,25.2 180 bottom
C110  56.5,22.7 180 bottom
C111  74,21.2 0 bottom
C112  90.5,12.7 180 top
C113  90.5,56.7 180 top
C201  68.5,20.2 270 top
C202  68.5,43.2 270 top
C203  72.5,24.7 90 top
C204  72.5,47.7 90 top
C205  39.5,30.2 180 top
C206  89.5,29.7 180 bottom
C207  39.5,39.2 180 top
C208  89.5,39.2 180 bottom
C301  66.5,41.2 90 top
C302  64.5,41.2 90 top
C303  49.5,34.2 270 top
C304  47.5,34.2 270 top
C305  44.5,38.2 270 top
D101  109.5,34.7 180 bottom
D102  45,31.2 0 bottom
D103  73.5,27.2 0 bottom
D201  102,28.7 90 top
D202  102,40.7 270 top
D203  104,23.7 270 bottom
D204  104,45.7 90 bottom
H101  6,34.7 0 top
H102  90.5,64.7 0 top
H103  90.5,4.7 0 top
J301  21.5,46.2 0 top
J302  109.5,23.7 90 bottom
J303  109.5,45.7 90 bottom
OP101  57,29.2 270 top
OP201  57,23.2 270 top
OP202  57,46.2 270 top
Q101  73,37.7 90 bottom
Q102  30.5,38.7 90 bottom
Q201  78.5,24.7 180 top
Q202  78.5,44.7 180 top
R101  48.5,31.2 180 top
R102  73.5,31.7 180 bottom
R103  79.5,33.7 270 bottom
R104  100.5,34.7 0 bottom
R105  18.5,28.7 90 bottom
R106  24.5,40.7 0 bottom
R107  23.5,33.7 180 top
R108  19.5,31.7 180 bottom
R109  16.5,30.7 90 bottom
R110  25,37.2 90 bottom
R111  45,28.7 0 bottom
R112  70,22.2 270 bottom
R201  48.5,25.2 0 top
R202  48.5,48.2 0 top
R203  65.5,21.2 0 top
R204  65.5,44.2 0 top
R205  70.5,20.2 90 top
R206  70.5,43.2 90 top
R207  73.5,27.7 0 top
R208  73.5,29.7 0 top
R209  73.5,50.7 0 top
R210  73.5,52.7 0 top
R211  103.5,17.2 270 top
R212  103.5,52.2 90 top
R213  85.5,31.7 90 bottom
R214  85.5,37.7 90 bottom
R301  66.5,37.2 270 top
R302  71,37.2 0 top
R303  64.5,37.2 90 top
R304  14,41.2 270 top
R305  26,41.2 270 top
R306  16,41.2 270 top
R307  24,41.2 270 top
R308  22,41.2 90 top
R309  49.5,38.2 270 top
T101  51.5,34.7 0 bottom
U101  21.5,36.2 180 bottom
U201  69.5,24.7 90 top
U202  69.5,47.7 90 top
U203  41,34.7 90 top
U204  88,34.7 90 bottom
U301  57,37.7 180 top
Y301  47,38.2 270 top

### Tracks (layer width: path | path; a pad name or v marks a point on that pad's centre or on a via)
+3V3
  Top 0.406: Y301.P6 Y301.P1 45.59,39.25 arc45 45.35,39.15 arc-45 45.11,39.05 C305.1 43.54,39.05 arc-45 43.3,39.15 arc45 43.18,39.2 C207.1 | 45.5,35.15 C304.1 48.31,35.15 arc-45 48.55,35.05 C303.1 50.15,35.05 arc90 50.5,35.4 arc-90 50.89,35.8 U301.14 | 45.5,35.15 44.62,35.15 arc-45 43.65,35.55 43.35,35.85 arc45 42.5,36.2 U203.3 | R101.2 46.35,31.2 arc-90 45.5,32.05 45.5,35.15
  pour Top (no thermals): 40.5,40.2 41.7,40.2 arc-90 42.2,39.7 42.2,36 arc-90 42,35.8 40.2,35.8 arc-90 40,36 40,39.7 arc-90
CHARGE  (via drill 0.35)
  Top 0.254: v20.5,36.7 18.54,36.7 arc-90 16,39.24 R306.2 R304.2
  Bottom 0.254: C104.1 v20.5,36.7 U101.3
CLK-
  Top 0.254: U301.12 50.86,38.34 arc-90 50.5,38.7 arc90 50.15,39.05 R309.1 48.9,39.05 arc90 48.6,38.75 48.6,38.45 arc-90 48.35,38.2 Y301.P5
COIL_CHIP
  pour Top (no thermals): 114,25.4 108.4,25.4 arc-90 107.5,26.3 107.5,26.7 arc90 105.5,28.7 99.75,28.7 arc90 98.4,27.35 98.4,18.55 arc-90 96.45,16.6 85.55,16.6 arc-90 83.6,18.55 83.6,30.85 arc-90 85.55,32.8 114,32.8
  pour Bottom (no thermals): 101.75,25.4 101.75,28.25 arc-90 101.95,28.45 110.5,28.45 arc-90 111,27.95 111,25.7 arc-90 110.25,24.95 102.2,24.95 arc-90
COIL_LINEAR
  pour Top (no thermals): 114,44 108.4,44 arc90 107.5,43.1 107.5,42.7 arc-90 105.5,40.7 99.75,40.7 arc-90 98.4,42.05 98.4,50.85 arc90 96.45,52.8 85.55,52.8 arc90 83.6,50.85 83.6,38.55 arc90 85.55,36.6 114,36.6
  pour Bottom (no thermals): 101.75,44.25 101.75,41.15 arc90 101.95,40.95 110.5,40.95 arc90 111,41.45 111,43.95 arc90 110.5,44.45 101.95,44.45 arc90
DATA+  (via drill 0.35)
  Top 0.254: U301.11 v50.86,39.61 arc90 v50.85,39.6
  Route2 0.254: v50.85,39.6 arc45 50,39.95 42.16,39.95 arc-45 39.24,41.16 38.35,42.05 arc45 36.9,42.65 22.93,42.65 arc-45 21.13,43.39 J301.10
DATA-  (via drill 0.35)
  Top 0.254: U301.10 50.88,40.88 arc90 v50.85,40.85
  Route2 0.254: v50.85,40.85 arc-45 50,40.5 42.75,40.5 arc-45 39.25,41.95 38.74,42.46 arc45 36.95,43.2 33.75,43.2 arc-90 33.5,43.45 33.5,43.6 arc90 33.25,43.85 arc90 33,43.6 33,43.45 arc-90 32.75,43.2 24.5,43.2 arc-90 23.41,44.3 J301.7
DISCHARGE
  Top 0.254: OP101.1 50.88,30.47 arc-90 50.5,30.85 arc90 50.15,31.2 R101.1 49.35,29.55 arc-90 48.5,28.7 46,28.7 arc90 45.05,27.75 45.05,26.7 arc-90 44.05,25.7 36,25.7 arc-90 33.5,28.2 33.5,36 arc90 30.8,38.7 24.5,38.7 arc-90 24,39.2 R307.2
GND  (via drill 0.35)
  Top 0.254: R304.1 14,43.69 arc-45 J301.14 | Y301.P3 v46.2,36.25
  Top 0.406: C304.2 48.43,33.25 arc45 48.55,33.3 arc-45 48.67,33.35 C303.2 50.61,33.35 arc-45 v50.85,33.25 U301.16 arc45 U301.16 | Y301.P3 45.64,37.15 arc-45 45.4,37.25 arc45 45.16,37.35 C305.2 | OP201.2 50.92,21.93 arc45 v50.85,21.9 | OP101.2 50.9,27.93 arc-45 v50.85,27.95 | 50.9,44.93 arc-45 v50.85,44.95 | U301.9 50.86,42.15 arc-45 v50.85,42.15
  Top 0.61: OP202.2 50.9,44.93
  Route2 0.61: v50.85,21.9 v50.85,27.95 v50.85,33.25 50.85,36.25 | 50.85,36.25 50.85,36.58 arc-45 51.5,38.15 arc45 51.9,39.12 51.9,41.1 arc90 v50.85,42.15 v50.85,44.95 | v46.2,36.25 50.85,36.25
  other vias: 8.9,48.5 34.5,48.7 36.5,48.7 38.5,48.7 40.5,48.7 42.5,48.7 44.5,48.7 46.5,48.7 6.5,47.7 4.3,46.3 2.7,44.3 1.5,41.9 0.9,38.9 0.9,36.1 0.9,33.1 0.9,30.3 1.7,27.9 2.7,25.9 4.3,23.9 6.3,22.3 8.1,21.1 10.5,20.7 12.5,20.7 14.5,20.7 16.5,20.7 18.5,20.7 20.5,20.7 22.5,20.7 24.5,20.7 26.5,20.7 32.5,20.7 34.5,20.7 36.5,20.7 38.5,20.7 40.5,20.7 42.5,20.7 44.5,20.7 46.5,20.7 48.5,20.7 31,31.2 31,29.2 29,29.2 27,29.2 27,31.2 25,29.2 25,27.2 27,27.2 29,27.2 31,27.2 9,22.7 9,25.2 6.5,24.7 7,27.2 4.5,26.7 9,27.2 9,29.2 7,29.2 5,29.2 3,29.2 3,39.2 5,39.2 7,39.2 9,39.2 9,41.2 7,41.2 5,41.2 3,41.7 5,43.7 7,43.7 9,43.7 7,45.7 9,46.2 9,31.2 3,31.2 20,40.2 42.5,43.7 48,43.7 49,46.7 38.5,44.7
  pour Bottom (no thermals): 10,43.4 arc-90 10.5,43.9 12,43.9 arc90 13,44.9 13,45.7 arc-90 13.5,46.2 13.75,46.2 arc90 14.25,46.7 14.25,48.2 arc-90 14.75,48.7 16.5,48.7 arc-90 17,48.2 17,46.7 arc-90 16.5,46.2 arc90 16.05,45.75 16.05,44.85 arc90 17,43.9 24.7,43.9 arc90 25.7,44.9 25.7,45.75 arc-90 26.15,46.2 26.4,46.2 arc90 27,46.8 27,47.7 arc-90 27.65,48.35 29.5,48.35 arc-90 30.05,47.8 30.05,46.7 arc-90 29.55,46.2 arc90 28.75,45.4 28.75,42.7 arc-90 27.75,41.7 20.6,41.7 arc90 20.3,41.4 20.3,40.25 arc-90 19.9,39.85 19.2,39.85 arc-90 18.8,40.25 18.8,42.1 arc90 18.45,42.45 16,42.45 arc90 15.55,42 15.55,40.2 arc90 16.05,39.7 16.5,39.7 arc-90 17,39.2 17,36.35 arc-90 16.55,35.9 16.1,35.9 arc90 15.65,35.45 15.65,31.1 arc90 16.05,30.7 17.15,30.7 arc90 17.4,30.95 17.4,31.4 arc-90 17.85,31.85 18.05,31.85 arc90 18.1,31.9 18.1,31.95 arc-90 18.35,32.2 18.95,32.2 arc-90 19.2,31.95 19.2,31.45 arc-90 18.95,31.2 18.35,31.2 arc-90 18.1,31.45 18.1,31.5 arc90 18.05,31.55 17.85,31.55 arc90 17.7,31.4 17.7,25.3 arc90 18.1,24.9 19.1,24.9 arc90 19.6,25.4 19.6,28.3 arc-90 20,28.7 23,28.7 arc90 24,29.7 24,32.95 arc90 23.8,33.15 23,33.15 arc-90 22.85,33.3 22.85,39.05 arc-90 22.95,39.15 23.3,39.15 arc-90 23.5,38.95 23.5,37.2 arc90 24,36.7 25.5,36.7 arc-90 26,36.2 26,35.2 arc90 26.5,34.7 30.5,34.7 arc-90 31.5,33.7 31.5,27.7 arc-90 30.5,26.7 27.5,26.7 arc90 26.5,25.7 26.5,21.7 arc-90 25.5,20.7 11,20.7 arc-90 10,21.7
  pour Top (no thermals): 39,28.75 36.8,28.75 arc-90 36.3,29.25 36.3,40.2 arc-90 36.8,40.7 39,40.7 arc-90 39.5,40.2 39.5,29.25 arc-90
  pour Bottom (rank 3): 52.5,19.2 52.5,50.7 -1,50.7 -1,19.2
  pour Top (rank 3): 52.5,51.2 52.5,18.2 -1,18.2 -1,51.2
  pour Route15 (rank 4, no thermals): 52.5,50.7 52.5,16.7 -2,16.7 -2,50.7
GND_HV  (via drill 0.35)
  Top 0.254: 78.4,19.35 arc-90 Q201.1
  Top 0.6: U202.P4 70.9,48.95 arc-45 71.5,48.7 arc45 71.86,48.55 C204.2 73.65,48.55 arc-90 74.5,47.7 74.5,42.35 | U201.P4 70.92,25.95 arc-45 71.4,25.75 arc45 71.88,25.55 C203.2 73.65,25.55 arc-90 74.5,24.7 74.5,19.35 | C201.2 R205.1 74.5,19.35 | C202.2 R206.1 74.5,42.35 | v76.5,42.7 arc-90 76.15,42.35 74.5,42.35 | 74.5,19.35 78.4,19.35 | U301.4 62.91,37.07 arc90 63.5,37.65 arc-90 63.9,38.05 R303.2 R301.1 67.76,39.31 arc45 68.5,41.1 C202.2 | U301.8 63.39,42.15 arc-45 63.5,42.1 arc45 63.62,42.05 C302.2 C301.2 67.14,42.05 arc45 67.5,42.2 arc-45 67.86,42.35 C202.2
  Top 0.61: OP101.3 63.45,27.93 arc45 v63.5,27.95
  Route15 0.61: D101.K 108.16,32.09 arc-45 107.22,31.7 93.9,31.7 arc-45 92.11,32.44 v89.85,34.7
  other vias: 80.5,42.7 80.5,41.7 79.5,41.7 79.5,42.7 78.5,42.7 78.5,41.7 76.5,41.7 77.5,42.7 77.5,41.7
  pour Top (no thermals): 81.5,20.7 81.5,17.2 arc90 84,14.7 85.5,14.7 arc-90 87.5,12.7 87.5,11.7 arc-90 85.5,9.7 83.5,9.7 arc-90 75.5,17.7 75.5,20.2 arc-90 76.5,21.2 81,21.2 arc-90
  pour Route2 (no thermals): 85.5,60.7 arc-90 90.5,55.7 90.5,13.7 arc-90 85.5,8.7 arc-90 77.5,16.7 77.5,27.05 arc90 77,27.55 63.5,27.55 arc-90 63.1,27.95 arc-90 63.5,28.35 77.05,28.35 arc90 77.5,28.8 77.5,39.2 arc90 76.5,40.2 arc-90 75.5,41.2 75.5,43.2 arc-90 76.5,44.2 arc90 77.5,45.2 77.5,52.7 arc-90
  pour Top (no thermals): 80.5,43.7 76.5,43.7 arc90 75.95,43.15 75.95,38.1 arc90 76.45,37.6 80.55,37.6 arc90 81.05,38.1 81.05,43.15 arc90
  pour Bottom (no thermals): 81.1,45.05 65.55,45.05 arc90 65.35,44.85 65.35,39.7 arc90 65.55,39.5 71,39.5 arc90 71.15,39.65 71.15,40.85 arc-90 71.5,41.2 81,41.2 arc90 81.55,41.75 81.55,44.6 arc90
  pour Bottom (no thermals): 92.2,39.2 92.2,29.22 arc-90 91.23,28.25 90.55,28.25 arc-90 90.1,28.7 90.1,34.05 arc90 89.85,34.3 arc-90 89.45,34.7 arc-90 89.85,35.1 89.9,35.1 arc90 90.1,35.3 90.1,39.8 arc-90 90.5,40.2 91.2,40.2 arc-90
  pour Bottom (no thermals): 105.25,22.25 105.25,20.1 arc-90 104.85,19.7 92.2,19.7 arc90 87.2,14.7 87.2,12.75 arc-90 85.5,11.05 85.45,11.05 arc-90 83.8,12.7 83.8,14.7 arc-90 91.8,22.7 104.8,22.7 arc-90
  pour Bottom (no thermals): 105.25,47.15 105.25,49.3 arc90 104.85,49.7 92.2,49.7 arc-90 87.2,54.7 87.2,56.65 arc90 85.5,58.35 85.45,58.35 arc90 83.8,56.7 83.8,54.7 arc90 91.8,46.7 104.8,46.7 arc90
  pour Route15 (no thermals): 75.5,70.7 75.5,-1.3 115.5,-1.3 115.5,70.7
KICK_CHIP
  Top 0.254: R201.1 36.05,25.2 arc-90 33,28.25 33,35.95 arc90 30.75,38.2 22.5,38.2 arc-90 22,38.7 R308.1
KICK_LINEAR
  Top 0.254: R305.2 31.1,40.35 arc45 32.89,41.09 37.26,45.46 arc-45 39.05,46.2 44.6,46.2 arc45 46.39,46.94 R202.1
N$1
  Bottom 0.254: U101.12 21.5,32.15 arc-90 21.05,31.7 R108.2
N$2
  Top 0.6: R204.1 63.8,44.2 arc-90 63.5,44.5 arc90 63.07,44.93 OP202.3
N$3
  pour Bottom (no thermals): 65.35,29.7 65.35,24.6 arc90 65.5,24.45 68.7,24.45 arc-90 69,24.15 69,23.2 arc90 69.5,22.7 70.5,22.7 arc90 71,23.2 71,24.2 arc-90 71.25,24.45 72.4,24.45 arc90 72.55,24.6 72.55,28.35 arc90 72.4,28.5 68.65,28.5 arc-90 68.55,28.6 68.55,29.75 arc90 68.35,29.95 65.6,29.95 arc90
N$4
  Bottom 0.254: U101.14 20.5,34.9 arc90 20,35.4 18.2,35.4 arc90 16.5,33.7 R109.2
N$5
  Top 0.6: R203.1 63.8,21.2 arc-90 63.5,21.5 arc90 63.07,21.93 OP201.3
N$6
  Top 0.254: U301.13 51,37.07 arc-45 50.55,37.25 arc45 50.31,37.35 R309.2 48.79,37.35 arc45 48.55,37.25 arc-45 48.31,37.15 Y301.P4
N$7
  pour Bottom (no thermals): 85.75,31.9 85.25,31.9 arc-90 84.9,32.25 84.9,32.9 arc-90 85.6,33.6 88.5,33.6 arc-90 88.7,33.4 88.7,33 arc-90 88.5,32.8 86.25,32.8 arc90 86.1,32.65 86.1,32.25 arc-90
N$8
  Bottom 0.254: U101.10 C108.1
N$9
  Bottom 0.61: D101.A R104.1
N$10
  pour Bottom (no thermals): 45.5,31.75 45.5,24.25 arc90 46,23.75 48.15,23.75 arc90 48.5,24.1 48.5,31.75 arc90 48.3,31.95 45.7,31.95 arc90
N$12
  Top 0.6: U301.2 65.78,34.53 arc90 66.5,35.25 R301.2
  pour Top (no thermals): 65.9,36.7 65.9,36 arc90 66.2,35.7 69.2,35.7 arc90 69.8,36.3 69.8,38.15 arc90 69.3,38.65 68.35,38.65 arc90 67.8,38.1 67.8,37.2 67.8,37.15 arc-90 67.65,37 66.2,37 arc90
N$13
  pour Bottom (no thermals): 28.45,39.7 arc90 28.3,39.85 27.1,39.85 arc90 27,39.75 arc-90 26.9,39.65 22.85,39.65 arc90 22.35,39.15 22.35,37.85 arc90 22.45,37.75 22.55,37.75 arc90 22.65,37.85 22.65,39.15 arc-90 22.85,39.35 23.85,39.35 arc-90 24,39.2 24,37.7 arc90 24.5,37.2 26.8,37.2 arc-90 27.05,36.95 27.05,36.3 arc90 27.15,36.2 28.35,36.2 arc90 28.45,36.3
N$14
  Bottom 0.254: U101.5 21.5,39.43 arc45 21.45,39.55 C105.1
N$15
  pour Bottom (no thermals): 85.75,37.5 85.25,37.5 arc90 84.9,37.15 84.9,36.5 arc90 85.6,35.8 88.5,35.8 arc90 88.7,36 88.7,36.4 arc90 88.5,36.6 86.25,36.6 arc-90 86.1,36.75 86.1,37.15 arc90
N$16
  Bottom 0.254: U101.11 22,32.2 arc-45 21.72,31.52 20.57,30.37 arc45 20.5,30.2 C106.1 R105.2
N$17
  pour Bottom (no thermals): 17.9,25.45 17.9,28.15 arc-90 18.25,28.5 18.95,28.5 arc-90 19.3,28.15 19.3,25.45 arc-90 18.95,25.1 18.25,25.1 arc-90
N$18
  pour Bottom (no thermals): 25,40.05 28.35,40.05 arc90 28.45,40.15 28.45,41.2 arc90 28.35,41.3 25.05,41.3 arc90 24.7,40.95 24.7,40.35 arc90
N$19
  Bottom 0.254: U101.6 22,39.3 arc-45 22.14,39.64 22.42,39.92 arc45 22.6,40.35 arc-90 22.95,40.7 R106.2
N$20
  Top 0.6: U301.3 63.24,35.8 arc90 63.5,36.05 arc-90 63.8,36.35 R303.1
N$21  (via drill 0.35)
  Top 0.254: R107.2 v18.5,33.7
  Bottom 0.254: U101.16 19.1,33.95 arc45 v18.5,33.7
N$22
  Top 0.6: U201.P6 68.5,26.7 arc-90 71.5,29.7 R208.1
N$23
  Top 0.6: U202.P6 68.5,49.7 arc-90 71.5,52.7 R210.1
N$24
  Top 0.6: R209.1 70.45,50.7 arc90 69.45,49.7 U202.P5
N$25
  Top 0.6: R210.2 R209.2 75.25,50.7 arc-90 75.5,50.45 arc90 75.8,50.15 Q202.2
N$26
  pour Bottom (no thermals): 72.2,22.1 72.2,20.3 71.2,20.3 arc90 71,20.1 arc-90 70.8,19.9 69.5,19.9 arc-90 69,20.4 69,21.6 arc-90 69.5,22.1
N$27
  Top 0.254: 67.6,44.15 arc45 67.48,44.2
  Top 0.6: C202.1 R206.2 | C202.1 67.84,44.05 arc-45 67.6,44.15 | 67.48,44.2 R204.2 | C202.1 68.5,44.9 arc-90 68.8,45.2 69.15,45.2 arc90 69.45,45.5 U202.P2
N$28
  Top 0.6: U201.P5 69.45,26.7 arc-90 70.45,27.7 R207.1
N$29
  Top 0.6: R207.2 R208.2 75.3,29.7 arc90 75.5,29.9 arc-90 75.75,30.15 Q201.2
N$30
  pour Top (no thermals): 99.8,42.1 99.8,48.9 arc-90 99.95,49.05 107.05,49.05 arc-90 107.2,48.9 107.2,45 arc-90 107.05,44.85 104.25,44.85 arc90 103.5,44.1 103.5,42.15 arc-90 103.3,41.95 99.95,41.95 arc-90
N$31
  Top 0.254: OP201.1 50.88,24.47 arc-90 50.5,24.85 arc90 50.15,25.2 R201.2
N$32
  Top 0.254: R306.1 16,42.82 arc-45 16.74,44.62 J301.12
N$33
  pour Top (no thermals): 99.8,27.3 99.8,20.5 arc90 99.95,20.35 107.05,20.35 arc90 107.2,20.5 107.2,24.4 arc90 107.05,24.55 104.25,24.55 arc-90 103.5,25.3 103.5,27.25 arc90 103.3,27.45 99.95,27.45 arc90
N$34
  Top 0.254: 67.4,21.1 arc45 67.52,21.05
  Top 0.6: R203.2 67.16,21.2 arc-45 67.4,21.1 | 67.52,21.05 C201.1 | C201.1 R205.2 | C201.1 68.5,21.95 arc-90 68.8,22.25 69.2,22.25 arc90 69.45,22.5 U201.P2
N$37
  Top 0.254: R305.1 26,43.1 arc45 25.64,43.96 J301.6
N$38
  Top 0.254: R307.1 24,43.2 arc45 23.75,43.8 arc-45 23.41,44.63 23.41,45.27 arc-45 23.68,45.93 23.82,46.07 arc-45 24.36,46.29 arc45 25.05,46.58 J301.5
N$39
  Top 0.6: U301.7 63.27,40.88 arc-90 63.5,40.65 arc90 63.8,40.35 C302.1
N$41  (via drill 0.35)
  Top 0.6: OP101.4 65.74,30.47 arc45 67.5,31.2 arc-45 68.71,31.7 v72.1,31.7
  pour Bottom (no thermals): 68.7,35.8 68.7,35 arc90 68.9,34.8 69.55,34.8 arc-90 69.7,34.65 69.7,30.55 arc90 70.25,30 71.15,30 arc90 71.7,30.55 71.7,30.95 arc-90 72.1,31.35 arc90 72.45,31.7 arc90 72.1,32.05 arc-90 71.65,32.5 71.69,35.41 arc90 71.2,35.9 68.8,35.9 arc90
N$42
  Top 0.254: R308.2 22,42.49 arc45 21.5,43.7 21.34,43.86 arc-45 20.85,45.05 20.85,45.25 arc45 20.6,45.85 20.5,45.95 arc45 19.9,46.2 arc-45 19.38,46.42 J301.11
N$43
  pour Bottom (no thermals): 74.7,38.25 68.85,38.25 arc90 68.7,38.1 68.7,37.3 arc90 68.85,37.15 74.6,37.15 arc-90 74.9,36.85 74.9,35.85 arc90 75.25,35.5 80.65,35.5 arc90 81.2,36.05 81.2,36.95 arc90 80.65,37.5 77.5,37.5 arc-90 77.3,37.7 77.3,39.4 arc90 77.1,39.6 75.1,39.6 arc90 74.9,39.4 74.9,38.45 arc-90
N$48
  Top 0.254: OP202.1 50.88,47.47 arc-90 50.5,47.85 arc90 50.15,48.2 R202.2
TRAFO  (via drill 0.35)
  Top 0.254: v30.5,36.6 28.41,34.52 arc-45 26.45,33.7 R107.1
  pour Bottom (no thermals): 29.1,41.4 29.1,35.95 arc90 29.35,35.7 31.5,35.7 arc-90 32.5,34.7 32.5,31.5 arc90 33.5,30.5 44,30.5 arc90 44.5,31 44.5,34.2 arc90 44,34.7 38.5,34.7 arc-90 38,35.2 38,37.7 arc90 37.5,38.2 35,38.2 arc-90 33.8,39.4 33.8,41.45 arc90 33.55,41.7 29.4,41.7 arc90
VCC  (via drill 0.35)
  Top 0.61: v40.9,27.35 C205.1
  Bottom 0.508: C110.1 43.5,22.7 v43.29,22.91
  other vias: 30.5,21.7 30.5,22.7 30.5,23.7 30.5,24.7 31.5,24.7 31.5,23.7 31.5,22.7 31.5,21.7 17.85,39.75 18.9,38.7
  pour Bottom (no thermals): 27.5,21.2 arc90 28,20.7 43.5,20.7 arc90 44.5,21.7 44.5,29.4 arc90 44,29.9 33.5,29.9 arc90 32.5,28.9 32.5,26.7 arc-90 31.5,25.7 28,25.7 arc90 27.5,25.2
  pour Bottom (no thermals): 19.75,39.1 19.75,37.85 arc-90 19.55,37.65 17.45,37.65 arc-90 17.2,37.9 17.2,40.05 arc90 17.05,40.2 17,40.2 arc-90 16.5,40.7 16.5,41.7 arc-90 17,42.2 18,42.2 arc-90 18.5,41.7 18.5,39.5 arc90 18.7,39.3 19.55,39.3 arc-90
  pour Route15 (no thermals): 31.5,21.25 arc90 32.5,22.25 32.5,24.7 arc90 31.5,25.7 16.65,25.7 arc-90 15.65,26.7 15.65,37.15 arc-90 16.15,37.65 18.95,37.65 arc90 19.5,38.2 19.5,41.2 arc-90 20,41.7 32,41.7 arc90 32.5,42.2 32.5,48.2 arc90 32,48.7 30,48.7 arc90 29.5,48.2 29.5,46.7 arc-90 29,46.2 28.75,46.2 arc90 28.25,45.7 28.25,44.65 arc-90 27.5,43.9 14,43.9 arc-90 13.5,44.4 13.5,45.7 arc-90 14,46.2 14.25,46.2 arc90 14.75,46.7 14.75,48.2 arc90 14.25,48.7 11,48.7 arc90 10.5,48.2 10.5,22.25 arc90 11.5,21.25
  pour Top (no thermals): 41.7,28.75 40.5,28.75 arc-90 40,29.25 40,33.4 arc-90 40.2,33.6 42,33.6 arc-90 42.2,33.4 42.2,29.25 arc-90
  pour Route2 (rank 3, no thermals): 52.5,51.7 52.5,16.7 -2,16.7 -2,51.7
VCC_HV  (via drill 0.35)
  Top 0.61: v74.75,33.75 73.48,35.02 arc-45 73.2,35.7 R302.2
  Bottom 0.61: R104.2 v96.35,34.7 | C110.2 62.95,22.7 arc-45 64.74,21.96 68.26,18.44 arc45 70.05,17.7 75.4,17.7 C111.1
  pour Route2 (no thermals): 92.5,55.7 92.5,13.7 arc90 97.5,8.7 arc90 105.5,16.7 105.5,52.7 arc90 97.5,60.7 arc90
  pour Bottom (no thermals): 74.4,33.75 74.4,16.8 arc90 85.5,5.7 90.5,5.7 arc90 97.5,12.7 arc90 95.5,14.7 arc90 93.5,12.7 arc-90 90.5,9.7 85.6,9.7 arc-90 80.5,14.8 80.5,27.35 arc-90 81.5,28.35 88.5,28.35 88.5,31.05 86.2,31.05 arc-90 86.1,31.15 arc90 85.75,31.5 81.45,31.5 arc-90 81.2,31.75 81.2,32.85 arc90 80.65,33.4 75.45,33.4 arc-90 75.1,33.75 arc90 74.75,34.1 arc90
  pour Top (no thermals): 95.5,54.7 99,54.7 arc-90 100.05,53.65 100.05,50.95 arc90 100.7,50.3 107.25,50.3 arc-90 108.45,49.1 108.45,48.4 arc90 109.5,47.35 113.5,47.35 113.5,60.7 95.5,60.7 arc90 93.5,58.7 93.5,56.7 arc90
  pour Top (no thermals): 95.5,14.7 99,14.7 arc90 100.05,15.75 100.05,18.45 arc-90 100.7,19.1 107.25,19.1 arc90 108.45,20.3 108.45,21 arc-90 109.5,22.05 113.5,22.05 113.5,8.7 95.5,8.7 arc-90 93.5,10.7 93.5,12.7 arc-90
VGATE_HV  (via drill 0.35)
  Top 0.6: OP201.4 68.5,24.47 | 68.5,24.47 70.4,24.47 | 70.4,24.47 71.18,24.47 arc-90 71.5,24.15 arc90 71.8,23.85 C203.1 | U201.P3 70.4,24.47 | U201.P1 68.5,24.47 | U202.P3 70.4,47.47 | U202.P1 68.5,47.47 | C301.1 66.5,39.65 arc-90 66.05,39.2 64,39.2 arc-45 63.4,39.45 arc45 63.03,39.61 U301.6 60,39.61
  Top 0.61: OP201.4 60.48,24.47 arc-90 60,24.95 60,39.61 60,46.9 arc-90 60.57,47.47 OP202.4 68.5,47.47 70.4,47.47 71.23,47.47 arc-90 71.5,47.2 arc90 71.85,46.85 C204.1 v72.5,45.9
  pour Bottom (no thermals): 84.9,38.2 84.9,42.1 arc90 81.5,45.5 72.5,45.5 arc-90 72.1,45.9 arc-90 72.5,46.3 81.5,46.3 arc-90 85.7,42.1 85.7,41.15 arc90 86.65,40.2 88.5,40.2 arc-90 89,39.7 89,38.2 arc-90 88.7,37.9 85.2,37.9 arc-90

### Text on the board
tPlace: PASTA KICKER 04